# Altium project atfc.PrjPcb (part 1 of 2)
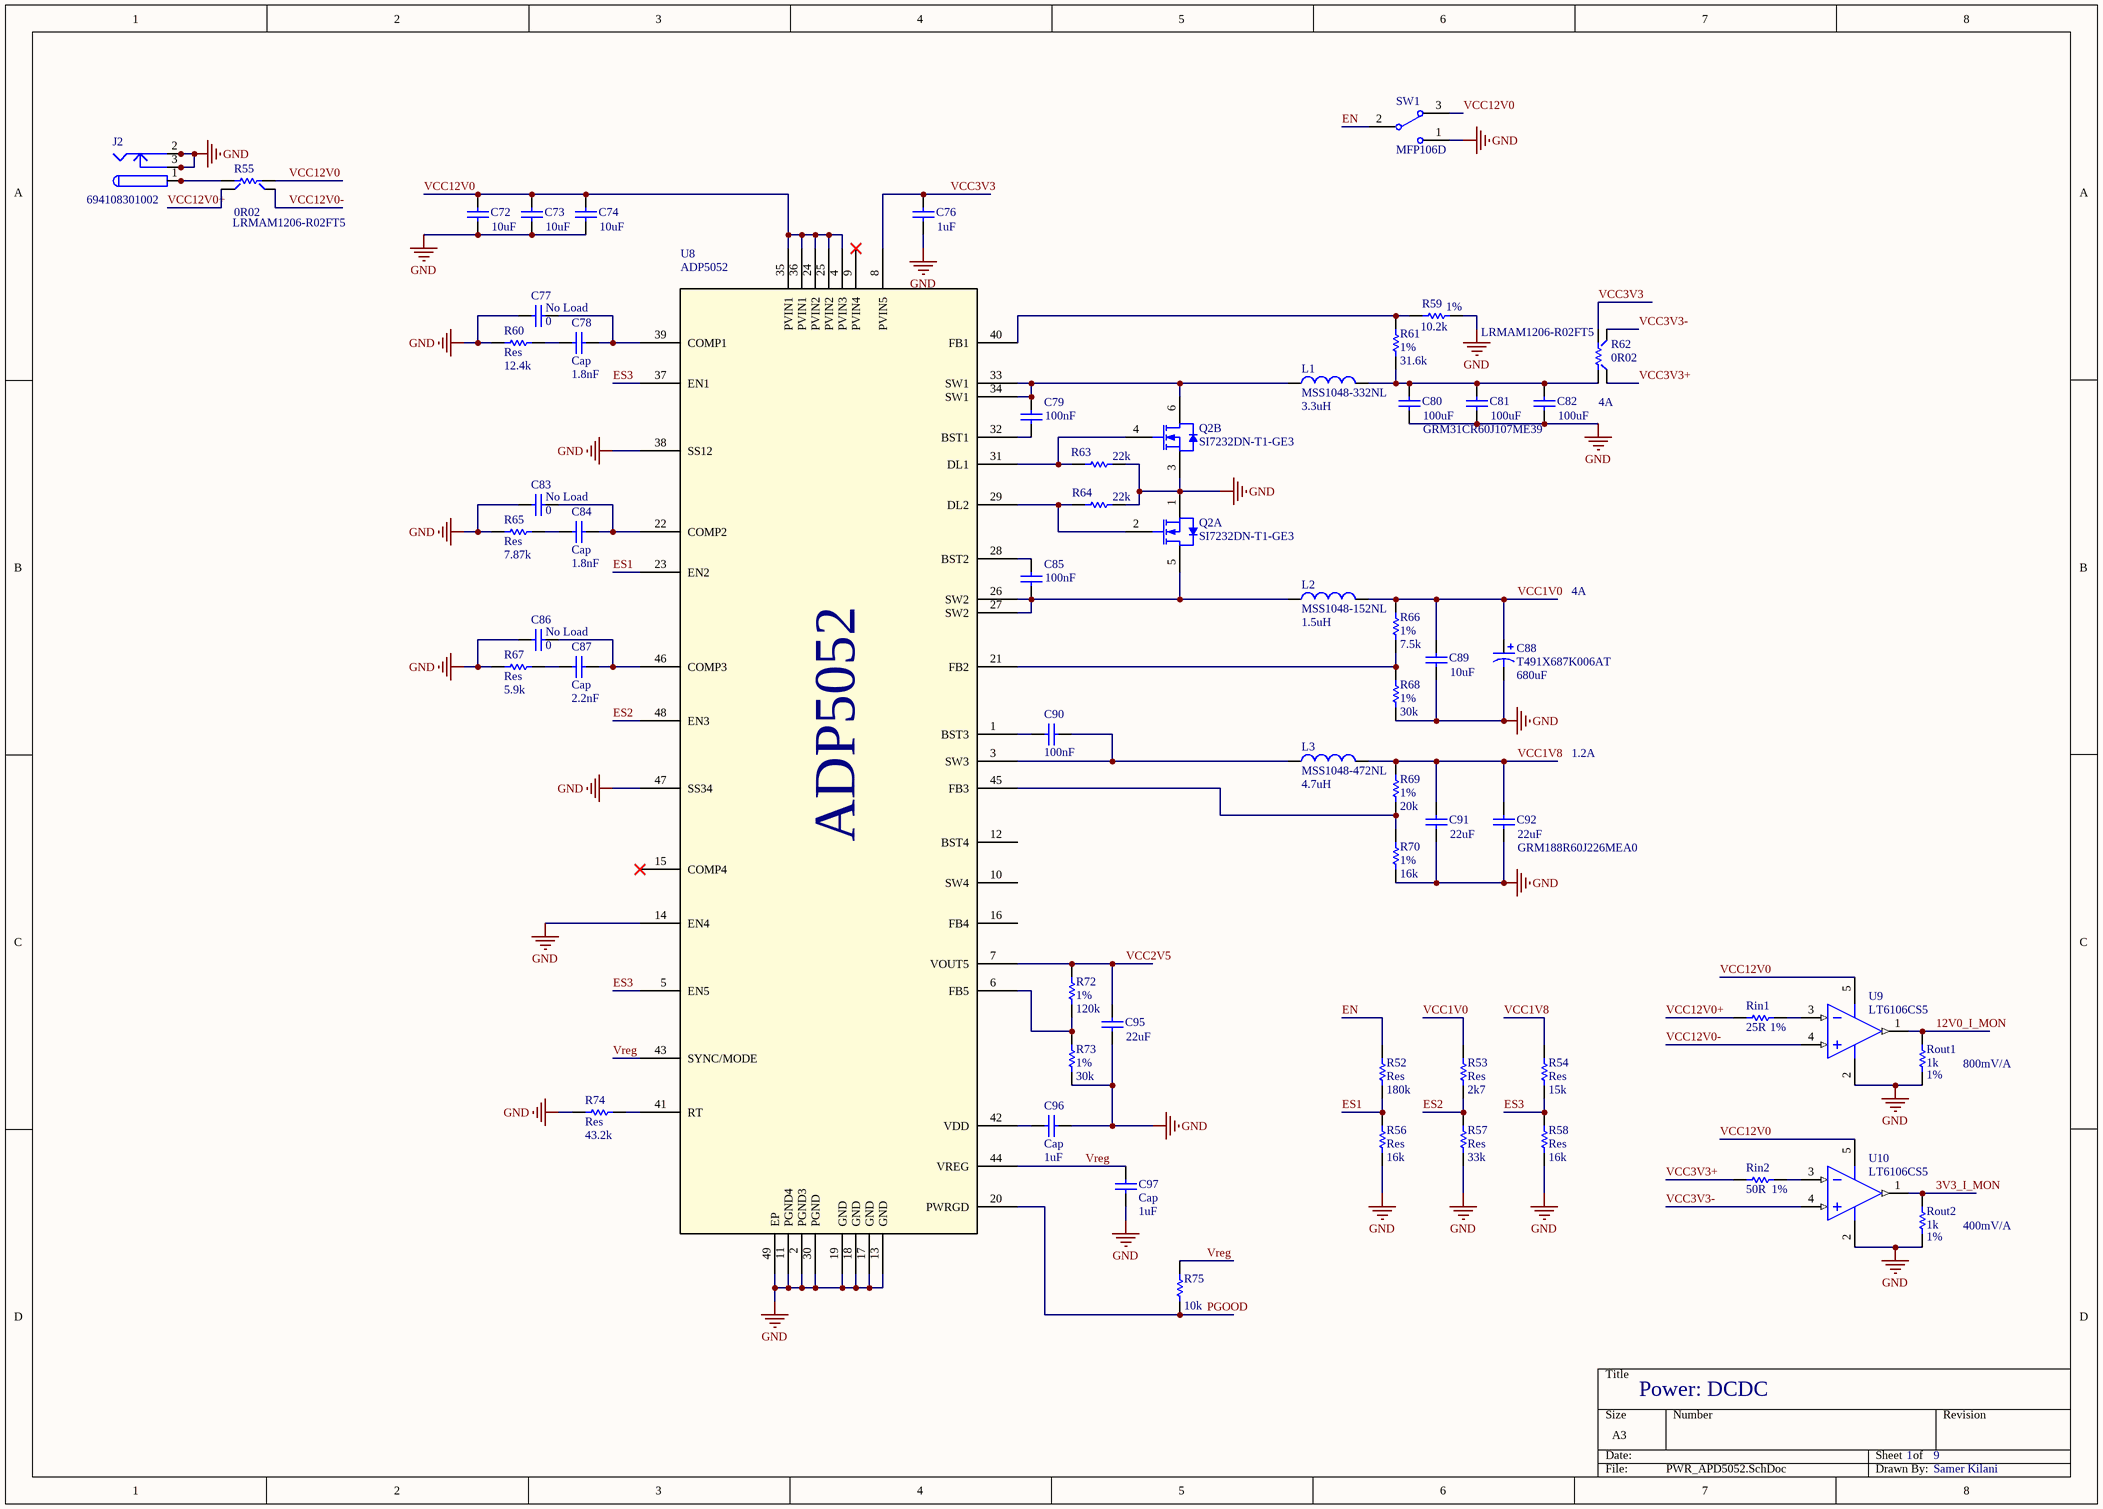
[diagram p0: PWR_APD5052.SchDoc]
Engineer: Samer Kilani
9 sheets, 292 parts. Net scope: global (net labels, ports and power ports of the same name join across sheets).
Board file: atfc.PcbDoc
Sheets:
  PWR_APD5052.SchDoc
  FPGA_PWR.SchDoc
  SFP.SchDoc
  IO.SchDoc
  FMC.SchDoc
  FPGA_Banks1.SchDoc
  FPGA_Banks2.SchDoc
  Regulators.SchDoc
  Config.SchDoc

## Sheet PWR_APD5052.SchDoc: Power: DCDC
size A3; Engineer: Samer Kilani; DocumentNumber: 1; SheetNumber: 1; SheetTotal: 9

### Parts
C72  value 10uF  [C0805]
C73  value 10uF  [C0805]
C74  value 10uF  [C0805]  (hidden comment: Cap)
C76  value 1uF  [C0402]
C77  No Load  value 0  [C0402]
C78  Cap  value 1.8nF  [C0402]
C79  value 100nF  [C0402]  (hidden comment: Cap)
C80  GRM31CR60J107ME39  value 100uF  [C1206]
C81  value 100uF  [C1206]  (hidden comment: GRM31CR60J107ME39)
C82  value 100uF  [C1206]  (hidden comment: GRM31CR60J107ME39)
C83  No Load  value 0  [C0402]
C84  Cap  value 1.8nF  [C0402]
C85  value 100nF  [C0402]  (hidden comment: Cap)
C86  No Load  value 0  [C0402]
C87  Cap  value 2.2nF  [C0402]
C88  T491X687K006AT  value 680uF  [C7343]
C89  value 10uF  [C0603]  (hidden comment: Cap)
C90  value 100nF  [C0402]  (hidden comment: Cap)
C91  value 22uF  [C0603]  (hidden comment: GRM188R60J226MEA0)
C92  GRM188R60J226MEA0  value 22uF  [C0603]
C95  value 22uF  [C0603]  (hidden comment: Cap)
C96  Cap  value 1uF  [C0402]
C97  Cap  value 1uF  [C0402]
J2  694108301002  [KLD-0202]
L1  MSS1048-332NL  value 3.3uH  [MSS1048]
L2  MSS1048-152NL  value 1.5uH  [MSS1048]
L3  MSS1048-472NL  value 4.7uH  [MSS1048]
Q2  SI7232DN-T1-GE3  [1212-8dual]  (parts A,B of 2)
R52  Res  value 180k  [R0402]
R53  Res  value 2k7  [R0402]
R54  Res  value 15k  [R0402]
R55  LRMAM1206-R02FT5  value 0R02  [LRMA1206]  (net tie)
R56  Res  value 16k  [R0402]
R57  Res  value 33k  [R0402]
R58  Res  value 16k  [R0402]
R59  value 10.2k  Tolerance: 1%  [R0402]  (hidden comment: Res)
R60  Res  value 12.4k  [R0402]
R61  value 31.6k  Tolerance: 1%  [R0402]  (hidden comment: Res)
R62  LRMAM1206-R02FT5  value 0R02  [LRMA1206]  (net tie)
R63  value 22k  [R0402]  (hidden comment: Res)
R64  value 22k  [R0402]  (hidden comment: Res)
R65  Res  value 7.87k  [R0402]
R66  value 7.5k  Tolerance: 1%  [R0402]  (hidden comment: Res)
R67  Res  value 5.9k  [R0402]
R68  value 30k  Tolerance: 1%  [R0402]  (hidden comment: Res)
R69  value 20k  Tolerance: 1%  [R0402]  (hidden comment: Res)
R70  value 16k  Tolerance: 1%  [R0402]  (hidden comment: Res)
R72  value 120k  Tolerance: 1%  [R0402]  (hidden comment: Res)
R73  value 30k  Tolerance: 1%  [R0402]  (hidden comment: Res)
R74  Res  value 43.2k  [R0402]
R75  value 10k  [R0402]  (hidden comment: Res)
Rin1  value 25R  Tolerance: 1%  [R0402]  (hidden comment: Res)
Rin2  value 50R  Tolerance: 1%  [R0402]  (hidden comment: Res)
Rout1  value 1k  Tolerance: 1%  [R0402]  (hidden comment: Res)
Rout2  value 1k  Tolerance: 1%  [R0402]  (hidden comment: Res)
SW1  MFP106D  [MFP106D]
U8  ADP5052  [CP_48_13]
U9  LT6106CS5  [LT-S5-5-TSOT-23_N]
U10  LT6106CS5  [LT-S5-5-TSOT-23_N]

### Nets
GND: C72.1 C73.1 C74.1 C76.1 C77.1 C80.1 C81.1 C82.1 C83.1 C86.1 C88.2 C89.1 C91.1 C92.1 C95.1 C96.1 C97.1 J2.2 J2.2A J2.2B J2.3 J2.3A J2.3B Q2.1(S1) Q2.3(S2) R56.1 R57.1 R58.1 R59.2 R60.1 R63.2 R64.2 R65.1 R67.1 R68.1 R70.1 R73.1 R74.1 Rout1.1 Rout2.1 SW1.1 U8.2(PGND3) U8.11(PGND4) U8.13(GND) U8.14(EN4) U8.17(GND) U8.18(GND) U8.19(GND) U8.30(PGND) U8.38(SS12) U8.47(SS34) U8.49(EP) U9.2(V-) U10.2(V-)
3V3_I_MON: Rout2.2 U10.1(OUT)
12V0_I_MON: Rout1.2 U9.1(OUT)
EN: R52.2 SW1.2
ES1: R52.1 R56.2 U8.23(EN2)
ES2: R53.1 R57.2 U8.48(EN3)
ES3: R54.1 R58.2 U8.5(EN5) U8.37(EN1)
PGOOD: R75.1 U8.20(PWRGD)
VCC1V0: C88.1 C89.2 L2.2 R53.2 R66.2
VCC1V8: C91.2 C92.2 L3.2 R54.2 R69.2
VCC2V5: C95.2 R72.2 U8.7(VOUT5)
VCC3V3: C76.2 R62.2 U8.8(PVIN5)
VCC3V3+: R62.3 Rin2.1
VCC3V3-: R62.4 U10.4(+IN)
VCC12V0: C72.2 C73.2 C74.2 R55.2 SW1.3 U8.4(PVIN3) U8.24(PVIN2) U8.25(PVIN2) U8.35(PVIN1) U8.36(PVIN1) U9.5(V+) U10.5(V+)
VCC12V0+: R55.3 Rin1.1
VCC12V0-: R55.4 U9.4(+IN)
Vreg: C97.2 R75.2 U8.43(SYNC/MODE) U8.44(VREG)
NetC77_2: C77.2 C78.2 U8.39(COMP1)
NetC78_1: C78.1 R60.2
NetC79_1: C79.1 U8.32(BST1)
NetC79_2: C79.2 L1.1 Q2.6(D2) U8.33(SW1) U8.34(SW1)
NetC80_2: C80.2 C81.2 C82.2 L1.2 R61.1 R62.1
NetC83_2: C83.2 C84.2 U8.22(COMP2)
NetC84_1: C84.1 R65.2
NetC85_1: C85.1 L2.1 Q2.5(D1) U8.26(SW2) U8.27(SW2)
NetC85_2: C85.2 U8.28(BST2)
NetC86_2: C86.2 C87.2 U8.46(COMP3)
NetC87_1: C87.1 R67.2
NetC90_1: C90.1 L3.1 U8.3(SW3)
NetC90_2: C90.2 U8.1(BST3)
NetC96_2: C96.2 U8.42(VDD)
NetJ2_1: J2.1 J2.1A J2.1B R55.1
NetQ2_2: Q2.2(G1) R64.1 U8.29(DL2)
NetQ2_4: Q2.4(G2) R63.1 U8.31(DL1)
NetR59_1: R59.1 R61.2 U8.40(FB1)
NetR66_1: R66.1 R68.2 U8.21(FB2)
NetR69_1: R69.1 R70.2 U8.45(FB3)
NetR72_1: R72.1 R73.2 U8.6(FB5)
NetR74_2: R74.2 U8.41(RT)
NetRin1_2: Rin1.2 U9.3(-IN)
NetRin2_2: Rin2.2 U10.3(-IN)

Not connected (* = marked no-connect by the designer): U8 9(PVIN4)* 10(SW4) 12(BST4) 15(COMP4)* 16(FB4)

### Notes on the sheet
- (near R62) 4A
- 4A
- 1.2A
- (near U8) ADP5052
- (near Rout1) 800mV/A
- (near Rout2) 400mV/A

### Library data of the parts
C72-C74 C76-C87 C89-C92 C95-C97 = Cap: Capacitor; Published: 8-Jun-2000; LatestRevisionDate: 17-Jul-2002; LatestRevisionNote: Re-released for DXP Platform.; PackageReference: RAD-0.3; Publisher: Altium Limited; PackageDescription: Radial Cap, Thru-Hole; 2 Leads; 0.3 in Pin Spacing
C88 = Cap Pol3: Polarized Capacitor (Surface Mount); Published: 8-Jun-2000; LatestRevisionDate: 29-May-2009; LatestRevisionNote: IPC-7351 Footprint Added.; PackageReference: C0805; Publisher: Altium Limited; PackageDescription: Chip Capacitor
J2 = PWR2.5: Low Voltage Power Supply Connector; Published: 17-Dec-2003; DatasheetDocument: 09-May-2002; Publisher: Altium Limited; ComponentLink1Description: Manufacturer Link; ComponentLink1URL: http://domino.kycon.com/internet/Products.html
L1-L3 = Inductor: Code_IEC: 1005; Published: 8-Jun-2000; LatestRevisionDate: 29-May-2009; LatestRevisionNote: IPC-7351 Footprint Added.; PackageReference: 0402-A; Publisher: Altium Limited; PackageDescription: Chip Inductor; Code_JEITA: 0402
R52-R54 R56-R61 R63-R70 R72-R75 Rin1 Rin2 Rout1 Rout2 = Res: Resistor
R55 R62 = Res_sense: Resistor
SW1 = SW-SPDT: SPDT Subminiature Toggle Switch, Right Angle Mounting, Vertical Actuation; Published: 24-Mar-1999; LatestRevisionDate: 17-Dec-2003; LatestRevisionNote: Schematic revised, PCB Footprint replaced.; DatasheetVersion: 05-Dec-2000; PackageReference: TL36WW15050; Publisher: Altium Limited; PackageDescription: Switch; 4 Leads; ComponentLink1Description: Manufacturer Link; ComponentLink1URL: http://www.apem.com
U8 = ADP5052ACPZ-R7: Imported; Value: Value; Type: Type; RefDes: RefDes
U9 U10 = LT6106CS5: Single Channel, Low Cost, High Side Current Sense Operational Amplifier, 0.2 MHz Typical GBW, 5-Pin SOT-23 (S5-5), Commercial; Linear Technology Part Number: LT6106; Manufacturer: Linear Technology; Channels (#): 1; GBW (MHz) Typical: 0.2; Is (mA) Typical: 0.06; Vos (mV) Guaranteed: 0.25; Vos (mV) Typical: 0.15; Vs Max (V): 36; Vs Min (V): 2.7; DatasheetVersion: Rev. A; PackageReference: LT-S5-5-TSOT-23; PackageDescription: 5-Lead Plastic TSOT-23, Body 1.63 x 2.90 mm, Pitch 0.95 mm; Type: CSA; Mounting Technology: Surface Mount; Code_JEDEC: MO-193; PartNumber: LT6106CS5; ComponentLink1Description: Manufacturer URL; ComponentLink1URL: http://www.linear.com/; ComponentLink2Description: Datasheet; ComponentLink2URL: http://cds.linear.com/docs/en/datasheet/6106fa.pdf; ComponentLink3Description: Package Specification; ComponentLink3URL: http://cds.linear.com/docs/en/packaging/SOT_5_05-08-1635.pdf

## Sheet FPGA_PWR.SchDoc: FPGA Power
size A4; Engineer: Samer Kilani; DocumentNumber: 2; SheetNumber: 2; SheetTotal: 9
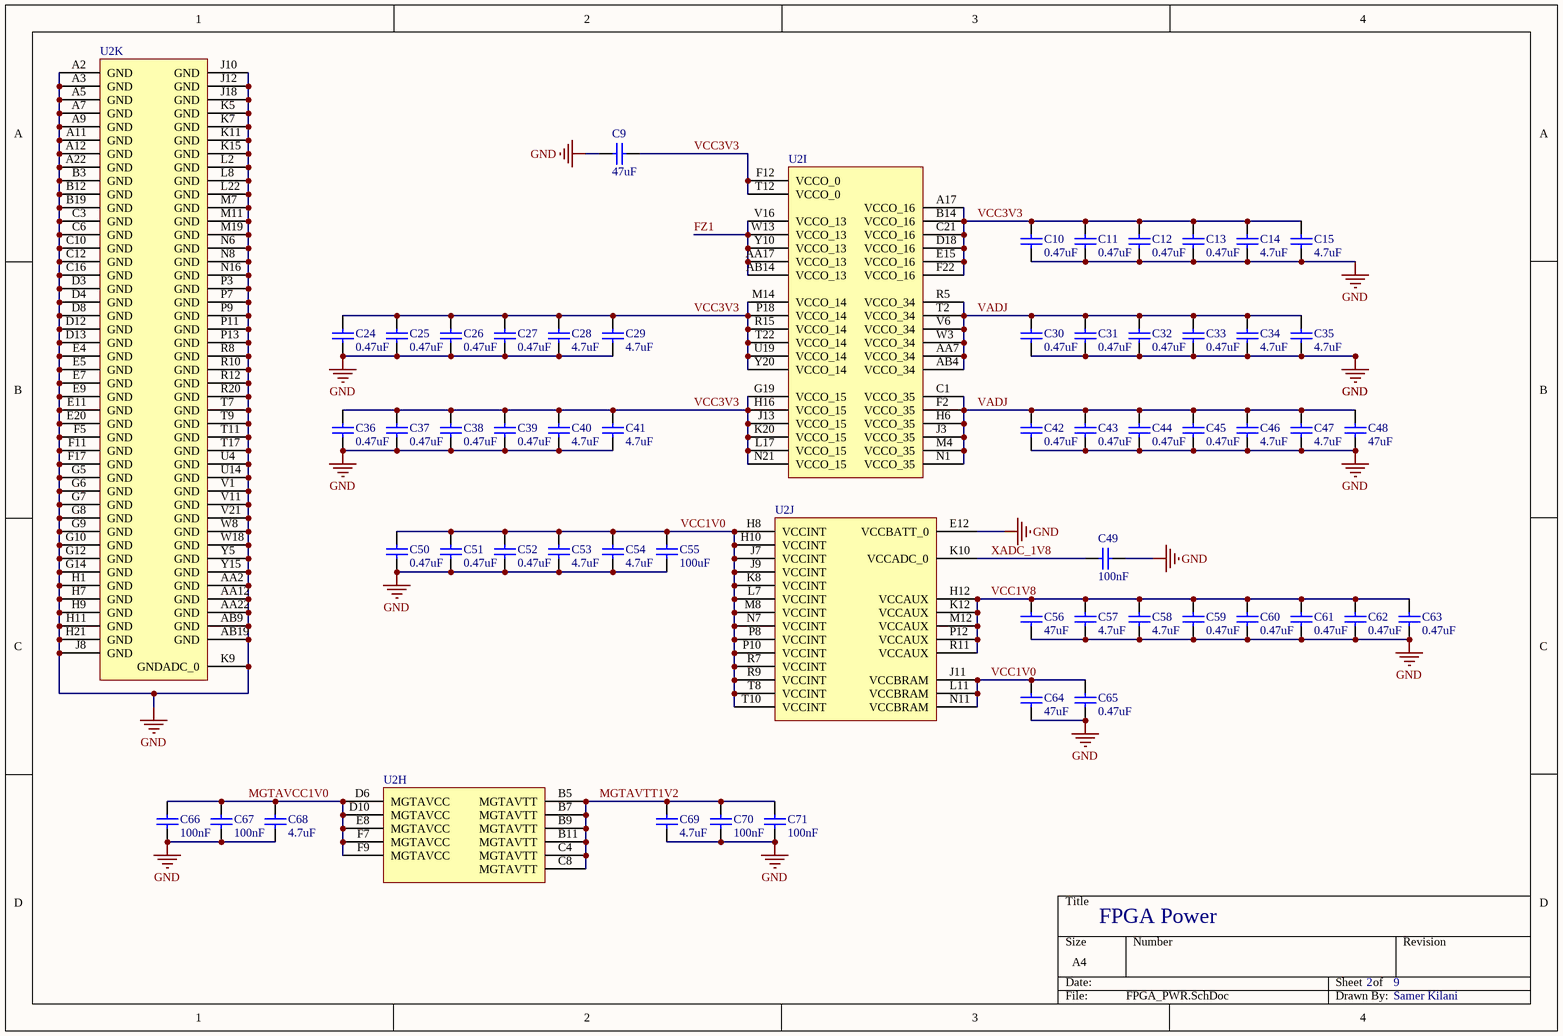
[diagram p1: FPGA_PWR.SchDoc]

### Parts
C9  value 47uF  [C1210]  (hidden comment: Cap)
C10  value 0.47uF  [C0402]  (hidden comment: Cap)
C11  value 0.47uF  [C0402]  (hidden comment: Cap)
C12  value 0.47uF  [C0402]  (hidden comment: Cap)
C13  value 0.47uF  [C0402]  (hidden comment: Cap)
C14  value 4.7uF  [C0805]  (hidden comment: Cap)
C15  value 4.7uF  [C0805]  (hidden comment: Cap)
C24  value 0.47uF  [C0402]  (hidden comment: Cap)
C25  value 0.47uF  [C0402]  (hidden comment: Cap)
C26  value 0.47uF  [C0402]  (hidden comment: Cap)
C27  value 0.47uF  [C0402]  (hidden comment: Cap)
C28  value 4.7uF  [C0805]  (hidden comment: Cap)
C29  value 4.7uF  [C0805]  (hidden comment: Cap)
C30  value 0.47uF  [C0402]  (hidden comment: Cap)
C31  value 0.47uF  [C0402]  (hidden comment: Cap)
C32  value 0.47uF  [C0402]  (hidden comment: Cap)
C33  value 0.47uF  [C0402]  (hidden comment: Cap)
C34  value 4.7uF  [C0805]  (hidden comment: Cap)
C35  value 4.7uF  [C0805]  (hidden comment: Cap)
C36  value 0.47uF  [C0402]  (hidden comment: Cap)
C37  value 0.47uF  [C0402]  (hidden comment: Cap)
C38  value 0.47uF  [C0402]  (hidden comment: Cap)
C39  value 0.47uF  [C0402]  (hidden comment: Cap)
C40  value 4.7uF  [C0805]  (hidden comment: Cap)
C41  value 4.7uF  [C0805]  (hidden comment: Cap)
C42  value 0.47uF  [C0402]  (hidden comment: Cap)
C43  value 0.47uF  [C0402]  (hidden comment: Cap)
C44  value 0.47uF  [C0402]  (hidden comment: Cap)
C45  value 0.47uF  [C0402]  (hidden comment: Cap)
C46  value 4.7uF  [C0805]  (hidden comment: Cap)
C47  value 4.7uF  [C0805]  (hidden comment: Cap)
C48  value 47uF  [C1210]  (hidden comment: Cap)
C49  value 100nF  [C0402]  (hidden comment: Cap)
C50  value 0.47uF  [C0402]  (hidden comment: Cap)
C51  value 0.47uF  [C0402]  (hidden comment: Cap)
C52  value 0.47uF  [C0402]  (hidden comment: Cap)
C53  value 4.7uF  [C0805]  (hidden comment: Cap)
C54  value 4.7uF  [C0805]  (hidden comment: Cap)
C55  value 100uF  [C1210]  (hidden comment: Cap)
C56  value 47uF  [C1210]  (hidden comment: Cap)
C57  value 4.7uF  [C0805]  (hidden comment: Cap)
C58  value 4.7uF  [C0805]  (hidden comment: Cap)
C59  value 0.47uF  [C0402]  (hidden comment: Cap)
C60  value 0.47uF  [C0402]  (hidden comment: Cap)
C61  value 0.47uF  [C0402]  (hidden comment: Cap)
C62  value 0.47uF  [C0402]  (hidden comment: Cap)
C63  value 0.47uF  [C0402]  (hidden comment: Cap)
C64  value 47uF  [C1210]  (hidden comment: Cap)
C65  value 0.47uF  [C0402]  (hidden comment: Cap)
C66  value 100nF  [C0402]  (hidden comment: Cap)
C67  value 100nF  [C0402]  (hidden comment: Cap)
C68  value 4.7uF  [C0805]  (hidden comment: Cap)
C69  value 4.7uF  [C0805]  (hidden comment: Cap)
C70  value 100nF  [C0402]  (hidden comment: Cap)
C71  value 100nF  [C0402]  (hidden comment: Cap)
U2  (no value)  [FGG484]  (parts H,I,J,K of 12)

### Nets
GND: C9.2 C10.2 C11.2 C12.2 C13.2 C14.2 C15.2 C24.2 C25.2 C26.2 C27.2 C28.2 C29.2 C30.2 C31.2 C32.2 C33.2 C34.2 C35.2 C36.2 C37.2 C38.2 C39.2 C40.2 C41.2 C42.2 C43.2 C44.2 C45.2 C46.2 C47.2 C48.2 C49.1 C50.2 C51.2 C52.2 C53.2 C54.2 C55.2 C56.2 C57.2 C58.2 C59.2 C60.2 C61.2 C62.2 C63.2 C64.2 C65.2 C66.2 C67.2 C68.2 C69.1 C70.1 C71.1 U2.A2(GND) U2.A3(GND) U2.A5(GND) U2.A7(GND) U2.A9(GND) U2.A11(GND) U2.A12(GND) U2.A22(GND) U2.AA2(GND) U2.AA12(GND) U2.AA22(GND) U2.AB9(GND) U2.AB19(GND) U2.B3(GND) U2.B12(GND) U2.B19(GND) U2.C3(GND) U2.C6(GND) U2.C10(GND) U2.C12(GND) U2.C16(GND) U2.D3(GND) U2.D4(GND) U2.D8(GND) U2.D12(GND) U2.D13(GND) U2.E4(GND) U2.E5(GND) U2.E7(GND) U2.E9(GND) U2.E11(GND) U2.E12(VCCBATT_0) U2.E20(GND) U2.F5(GND) U2.F11(GND) U2.F17(GND) U2.G5(GND) U2.G6(GND) U2.G7(GND) U2.G8(GND) U2.G9(GND) U2.G10(GND) U2.G12(GND) U2.G14(GND) U2.H1(GND) U2.H7(GND) U2.H9(GND) U2.H11(GND) U2.H21(GND) U2.J8(GND) U2.J10(GND) U2.J12(GND) U2.J18(GND) U2.K5(GND) U2.K7(GND) U2.K9(GNDADC_0) U2.K11(GND) U2.K15(GND) U2.L2(GND) U2.L8(GND) U2.L22(GND) U2.M7(GND) U2.M11(GND) U2.M19(GND) U2.N6(GND) U2.N8(GND) U2.N16(GND) U2.P3(GND) U2.P7(GND) U2.P9(GND) U2.P11(GND) U2.P13(GND) U2.R8(GND) U2.R10(GND) U2.R12(GND) U2.R20(GND) U2.T7(GND) U2.T9(GND) U2.T11(GND) U2.T17(GND) U2.U4(GND) U2.U14(GND) U2.V1(GND) U2.V11(GND) U2.V21(GND) U2.W8(GND) U2.W18(GND) U2.Y5(GND) U2.Y15(GND)
FZ1: U2.AA17(VCCO_13) U2.AB14(VCCO_13) U2.V16(VCCO_13) U2.W13(VCCO_13) U2.Y10(VCCO_13)
MGTAVCC1V0: C66.1 C67.1 C68.1 U2.D6(MGTAVCC) U2.D10(MGTAVCC) U2.E8(MGTAVCC) U2.F7(MGTAVCC) U2.F9(MGTAVCC)
MGTAVTT1V2: C69.2 C70.2 C71.2 U2.B5(MGTAVTT) U2.B7(MGTAVTT) U2.B9(MGTAVTT) U2.B11(MGTAVTT) U2.C4(MGTAVTT) U2.C8(MGTAVTT)
VADJ: C30.1 C31.1 C32.1 C33.1 C34.1 C35.1 C42.1 C43.1 C44.1 C45.1 C46.1 C47.1 C48.1 U2.AA7(VCCO_34) U2.AB4(VCCO_34) U2.C1(VCCO_35) U2.F2(VCCO_35) U2.H6(VCCO_35) U2.J3(VCCO_35) U2.M4(VCCO_35) U2.N1(VCCO_35) U2.R5(VCCO_34) U2.T2(VCCO_34) U2.V6(VCCO_34) U2.W3(VCCO_34)
VCC1V0: C50.1 C51.1 C52.1 C53.1 C54.1 C55.1 C64.1 C65.1 U2.H8(VCCINT) U2.H10(VCCINT) U2.J7(VCCINT) U2.J9(VCCINT) U2.J11(VCCBRAM) U2.K8(VCCINT) U2.L7(VCCINT) U2.L11(VCCBRAM) U2.M8(VCCINT) U2.N7(VCCINT) U2.N11(VCCBRAM) U2.P8(VCCINT) U2.P10(VCCINT) U2.R7(VCCINT) U2.R9(VCCINT) U2.T8(VCCINT) U2.T10(VCCINT)
VCC1V8: C56.1 C57.1 C58.1 C59.1 C60.1 C61.1 C62.1 C63.1 U2.H12(VCCAUX) U2.K12(VCCAUX) U2.M12(VCCAUX) U2.P12(VCCAUX) U2.R11(VCCAUX)
VCC3V3: C9.1 C10.1 C11.1 C12.1 C13.1 C14.1 C15.1 C24.1 C25.1 C26.1 C27.1 C28.1 C29.1 C36.1 C37.1 C38.1 C39.1 C40.1 C41.1 U2.A17(VCCO_16) U2.B14(VCCO_16) U2.C21(VCCO_16) U2.D18(VCCO_16) U2.E15(VCCO_16) U2.F12(VCCO_0) U2.F22(VCCO_16) U2.G19(VCCO_15) U2.H16(VCCO_15) U2.J13(VCCO_15) U2.K20(VCCO_15) U2.L17(VCCO_15) U2.M14(VCCO_14) U2.N21(VCCO_15) U2.P18(VCCO_14) U2.R15(VCCO_14) U2.T12(VCCO_0) U2.T22(VCCO_14) U2.U19(VCCO_14) U2.Y20(VCCO_14)
XADC_1V8: C49.2 U2.K10(VCCADC_0)

### Library data of the parts
C9-C15 C24-C71 = Cap: Capacitor; Published: 8-Jun-2000; LatestRevisionDate: 17-Jul-2002; LatestRevisionNote: Re-released for DXP Platform.; PackageReference: RAD-0.3; Publisher: Altium Limited; PackageDescription: Radial Cap, Thru-Hole; 2 Leads; 0.3 in Pin Spacing
U2 = XC7A35T-1FGG484C: Artix-7 FPGA, 250 User I/Os, 4 GTP, 484-Ball BGA, Speed Grade 1, Commercial Grade, Pb-Free; Manufacturer: Xilinx; Total Block RAM: 1800 Kb; GTP: 4; Clock Mgmt Tiles (CMTs): 5; Logic Cells: 33280; Available User I/O: 250; Speed Grades: 1; DatasheetVersion: v1.15; PackageVersion: Rev. 1.11; PackageReference: FGG484; PackageDescription: 484-Ball Wire-Bond Fine-Pitch BGA, Body 23 x 23 mm, Pitch 1 mm; Maximum Distributed RAM: 400 Kb; Operating Temperature Range: Commercial; NexusDeviceID: XC7A35T-1FGG484C; Mounting Technology: Surface Mount; PartNumber: XC7A35T-1FGG484C; ComponentLink1Description: Manufacturer URL; ComponentLink1URL: http://www.xilinx.com/; ComponentLink2Description: Datasheet; ComponentLink2URL: http://www.xilinx.com/support/documentation/data_sheets/ds180_7Series_Overview.pdf; ComponentLink3Description: Package Specification; ComponentLink3URL: http://www.xilinx.com/support/documentation/user_guides/ug475_7Series_Pkg_Pinout.pdf; ComponentLink4Description: DC and Switching Characteristics; ComponentLink4URL: http://www.xilinx.com/support/documentation/data_sheets/ds181_Artix_7_Data_Sheet.pdf; ComponentLink5Description: Package File; ComponentLink5URL: http://www.xilinx.com/support/packagefiles/a7packages/xc7a200tsbg484pkg.txt; ComponentLink6Description: Packaging and Pinout; ComponentLink6URL: http://www.xilinx.com/support/documentation/user_guides/ug475_7Series_Pkg_Pinout.pdf

## Sheet SFP.SchDoc: SFP
size OrCAD A; Engineer: Samer Kilani; DocumentNumber: 3; SheetNumber: 3; SheetTotal: 9
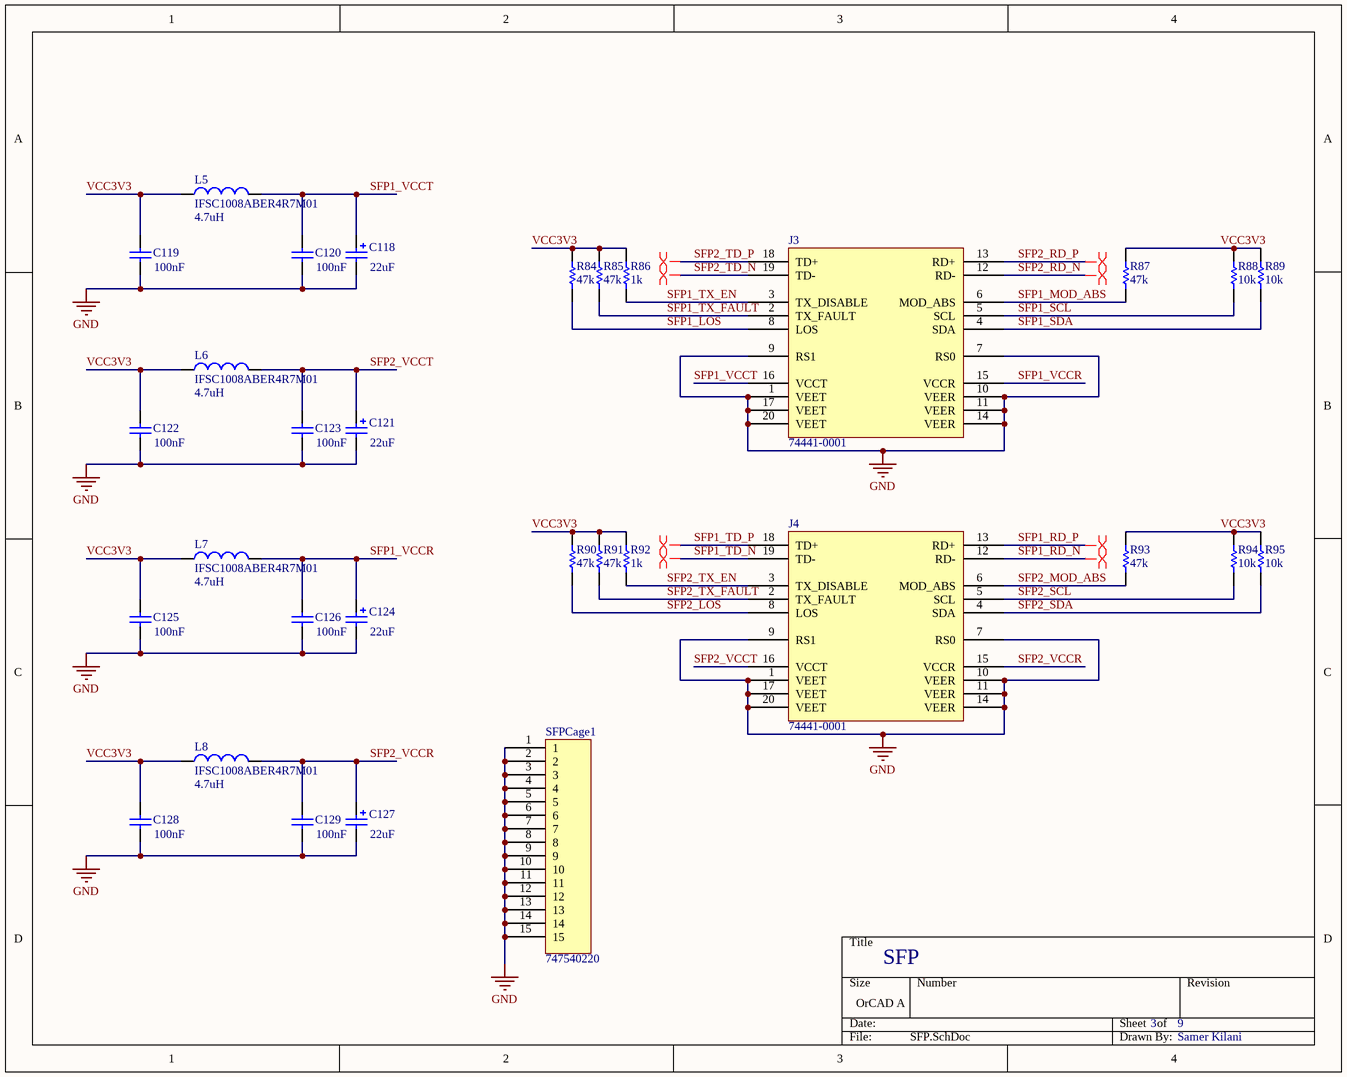
[diagram p2: SFP.SchDoc]

### Parts
C118  value 22uF  [C1206_P]
C119  value 100nF  [C0402]  (hidden comment: Cap)
C120  value 100nF  [C0402]  (hidden comment: Cap)
C121  value 22uF  [C1206_P]
C122  value 100nF  [C0402]  (hidden comment: Cap)
C123  value 100nF  [C0402]  (hidden comment: Cap)
C124  value 22uF  [C1206_P]
C125  value 100nF  [C0402]  (hidden comment: Cap)
C126  value 100nF  [C0402]  (hidden comment: Cap)
C127  value 22uF  [C1206_P]
C128  value 100nF  [C0402]  (hidden comment: Cap)
C129  value 100nF  [C0402]  (hidden comment: Cap)
J3  74441-0001  [SFP+20]
J4  74441-0001  [SFP+20]
L5  IFSC1008ABER4R7M01  value 4.7uH  [IFSC-ER]
L6  IFSC1008ABER4R7M01  value 4.7uH  [IFSC-ER]
L7  IFSC1008ABER4R7M01  value 4.7uH  [IFSC-ER]
L8  IFSC1008ABER4R7M01  value 4.7uH  [IFSC-ER]
R84  value 47k  [R0603]  (hidden comment: Res)
R85  value 47k  [R0603]  (hidden comment: Res)
R86  value 1k  [R0603]  (hidden comment: Res)
R87  value 47k  [R0603]  (hidden comment: Res)
R88  value 10k  [R0603]  (hidden comment: Res)
R89  value 10k  [R0603]  (hidden comment: Res)
R90  value 47k  [R0603]  (hidden comment: Res)
R91  value 47k  [R0603]  (hidden comment: Res)
R92  value 1k  [R0603]  (hidden comment: Res)
R93  value 47k  [R0603]  (hidden comment: Res)
R94  value 10k  [R0603]  (hidden comment: Res)
R95  value 10k  [R0603]  (hidden comment: Res)
SFPCage1  747540220  [SFPcage - dual]

### Nets
GND: C118.2 C119.1 C120.1 C121.2 C122.1 C123.1 C124.2 C125.1 C126.1 C127.2 C128.1 C129.1 J3.1(VEET) J3.7(RS0) J3.9(RS1) J3.10(VEER) J3.11(VEER) J3.14(VEER) J3.17(VEET) J3.20(VEET) J4.1(VEET) J4.7(RS0) J4.9(RS1) J4.10(VEER) J4.11(VEER) J4.14(VEER) J4.17(VEET) J4.20(VEET) SFPCage1.1 SFPCage1.2 SFPCage1.3 SFPCage1.4 SFPCage1.5 SFPCage1.6 SFPCage1.7 SFPCage1.8 SFPCage1.9 SFPCage1.10 SFPCage1.11 SFPCage1.12 SFPCage1.13 SFPCage1.14 SFPCage1.15
SFP1_LOS: J3.8(LOS) R84.2
SFP1_MOD_ABS: J3.6(MOD_ABS) R87.2
SFP1_RD_N: J4.12(RD-)
SFP1_RD_P: J4.13(RD+)
SFP1_SCL: J3.5(SCL) R88.2
SFP1_SDA: J3.4(SDA) R89.2
SFP1_TD_N: J4.19(TD-)
SFP1_TD_P: J4.18(TD+)
SFP1_TX_EN: J3.3(TX_DISABLE) R86.2
SFP1_TX_FAULT: J3.2(TX_FAULT) R85.2
SFP1_VCCR: C124.1 C126.2 J3.15(VCCR) L7.2
SFP1_VCCT: C118.1 C120.2 J3.16(VCCT) L5.2
SFP2_LOS: J4.8(LOS) R90.2
SFP2_MOD_ABS: J4.6(MOD_ABS) R93.2
SFP2_RD_N: J3.12(RD-)
SFP2_RD_P: J3.13(RD+)
SFP2_SCL: J4.5(SCL) R94.2
SFP2_SDA: J4.4(SDA) R95.2
SFP2_TD_N: J3.19(TD-)
SFP2_TD_P: J3.18(TD+)
SFP2_TX_EN: J4.3(TX_DISABLE) R92.2
SFP2_TX_FAULT: J4.2(TX_FAULT) R91.2
SFP2_VCCR: C127.1 C129.2 J4.15(VCCR) L8.2
SFP2_VCCT: C121.1 C123.2 J4.16(VCCT) L6.2
VCC3V3: C119.2 C122.2 C125.2 C128.2 L5.1 L6.1 L7.1 L8.1 R84.1 R85.1 R86.1 R87.1 R88.1 R89.1 R90.1 R91.1 R92.1 R93.1 R94.1 R95.1

### Layout directives
differential pair: SFP1_RD_N, SFP1_RD_P, SFP1_TD_N, SFP1_TD_P, SFP2_RD_N, SFP2_RD_P, SFP2_TD_N, SFP2_TD_P

### Library data of the parts
C118 C121 C124 C127 = Cap Pol: Polarized Capacitor (Surface Mount); Published: 8-Jun-2000; LatestRevisionDate: 29-May-2009; LatestRevisionNote: IPC-7351 Footprint Added.; PackageReference: C0805; Publisher: Altium Limited; PackageDescription: Chip Capacitor
C119 C120 C122 C123 C125 C126 C128 C129 = Cap: Capacitor; Published: 8-Jun-2000; LatestRevisionDate: 17-Jul-2002; LatestRevisionNote: Re-released for DXP Platform.; PackageReference: RAD-0.3; Publisher: Altium Limited; PackageDescription: Radial Cap, Thru-Hole; 2 Leads; 0.3 in Pin Spacing
J3 J4 = SFP+
L5-L8 = Inductor: Code_IEC: 1005; Published: 8-Jun-2000; LatestRevisionDate: 29-May-2009; LatestRevisionNote: IPC-7351 Footprint Added.; PackageReference: 0402-A; Publisher: Altium Limited; PackageDescription: Chip Inductor; Code_JEITA: 0402
R84-R95 = Res: Resistor
SFPCage1 = SFPcagedual

## Sheet IO.SchDoc: IO
size A4; Engineer: Samer Kilani; DocumentNumber: 4; SheetNumber: 4; SheetTotal: 9
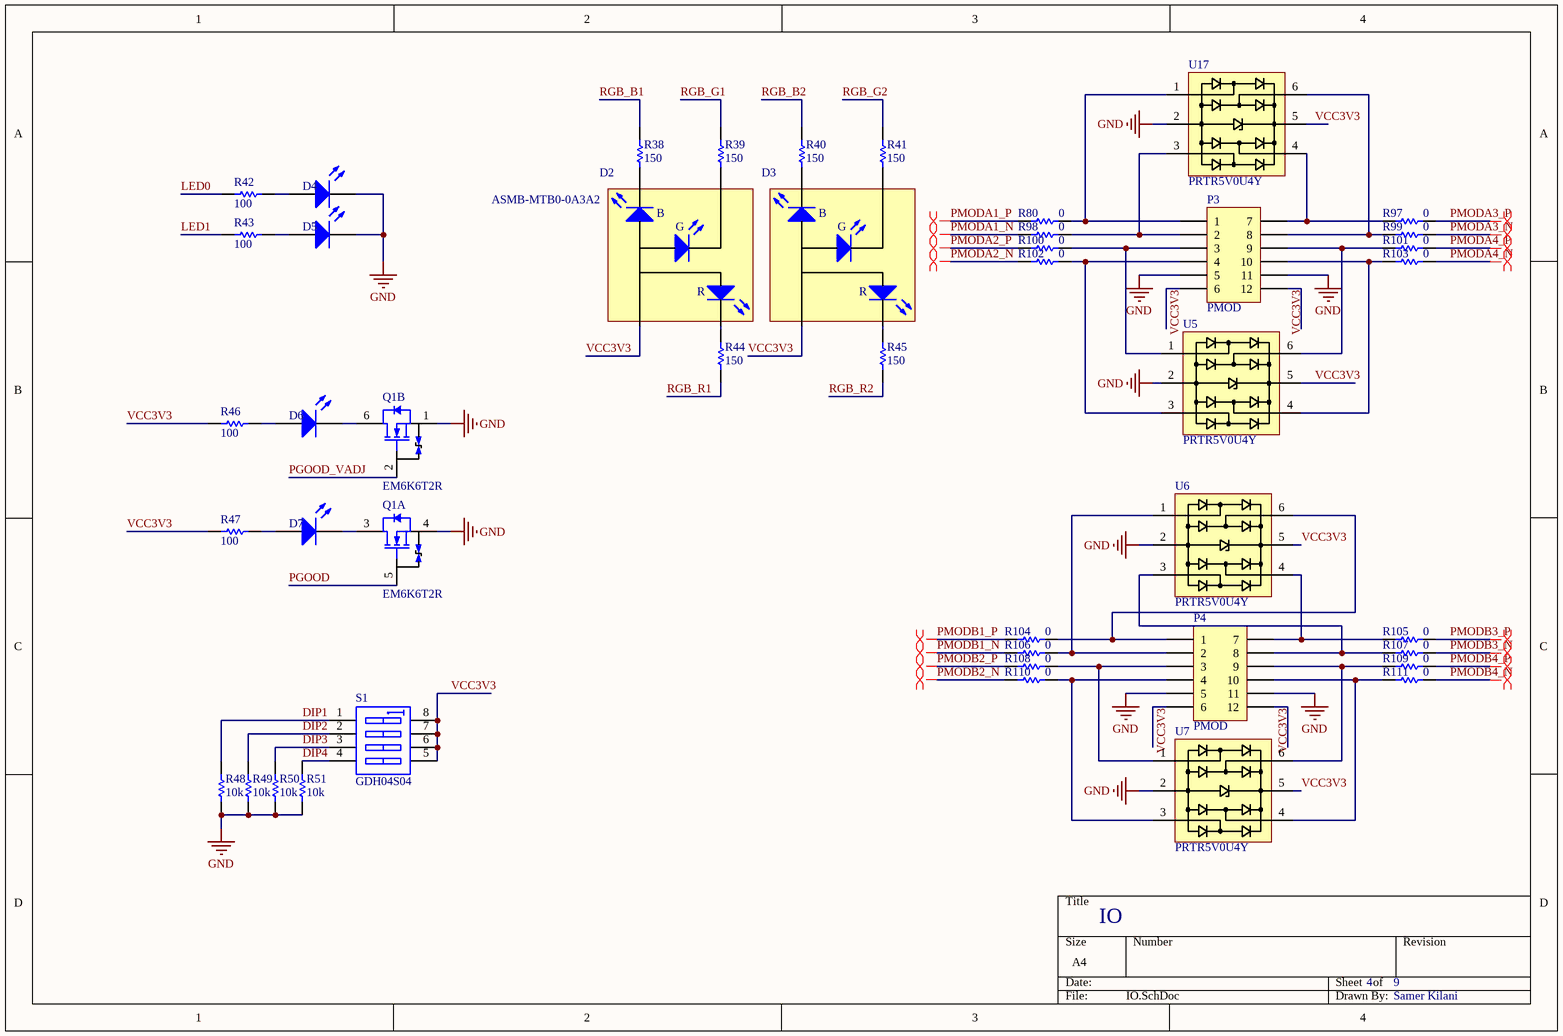
[diagram p3: IO.SchDoc]

### Parts
D2  ASMB-MTB0-0A3A2  [ASMB-MTB0-0A3A2]
D3  ASMB-MTB0-0A3A2  [ASMB-MTB0-0A3A2]  (value not drawn)
D4  KPT-1608EC  [KP-1608QBC-D]  (value not drawn)
D5  KPT-1608EC  [KP-1608QBC-D]  (value not drawn)
D6  KPT-1608EC  [KP-1608QBC-D]  (value not drawn)
D7  KPT-1608EC  [KP-1608QBC-D]  (value not drawn)
P3  PMOD  [PMOD_12]
P4  PMOD  [PMOD_12]
Q1  EM6K6T2R  [SOT-563]  (parts A,B of 2)
R38  value 150  [R0402]  (hidden comment: Res)
R39  value 150  [R0402]  (hidden comment: Res)
R40  value 150  [R0402]  (hidden comment: Res)
R41  value 150  [R0402]  (hidden comment: Res)
R42  value 100  [R0402]  (hidden comment: Res)
R43  value 100  [R0402]  (hidden comment: Res)
R44  value 150  [R0402]  (hidden comment: Res)
R45  value 150  [R0402]  (hidden comment: Res)
R46  value 100  [R0402]  (hidden comment: Res)
R47  value 100  [R0402]  (hidden comment: Res)
R48  value 10k  [R0402]  (hidden comment: Res)
R49  value 10k  [R0402]  (hidden comment: Res)
R50  value 10k  [R0402]  (hidden comment: Res)
R51  value 10k  [R0402]  (hidden comment: Res)
R80  value 0  [R0402]  (hidden comment: Res)
R97  value 0  [R0402]  (hidden comment: Res)
R98  value 0  [R0402]  (hidden comment: Res)
R99  value 0  [R0402]  (hidden comment: Res)
R100  value 0  [R0402]  (hidden comment: Res)
R101  value 0  [R0402]  (hidden comment: Res)
R102  value 0  [R0402]  (hidden comment: Res)
R103  value 0  [R0402]  (hidden comment: Res)
R104  value 0  [R0402]  (hidden comment: Res)
R105  value 0  [R0402]  (hidden comment: Res)
R106  value 0  [R0402]  (hidden comment: Res)
R107  value 0  [R0402]  (hidden comment: Res)
R108  value 0  [R0402]  (hidden comment: Res)
R109  value 0  [R0402]  (hidden comment: Res)
R110  value 0  [R0402]  (hidden comment: Res)
R111  value 0  [R0402]  (hidden comment: Res)
S1  GDH04S04  [DIP-SOP8]
U5  PRTR5V0U4Y  [SOT363]
U6  PRTR5V0U4Y  [SOT363]
U7  PRTR5V0U4Y  [SOT363]
U17  PRTR5V0U4Y  [SOT363]

### Nets
GND: D4.2(K) D5.2(K) P3.5 P3.11 P4.5 P4.11 Q1.1(S1) Q1.4(S1) R48.2 R49.2 R50.2 R51.2 U5.2 U6.2 U7.2 U17.2
DIP1: R48.1 S1.1(A1)
DIP2: R49.1 S1.2(A2)
DIP3: R50.1 S1.3(A3)
DIP4: R51.1 S1.4(A4)
LED0: R42.2
LED1: R43.2
PGOOD: Q1.5(G1)
PGOOD_VADJ: Q1.2(G1)
PMODA1_N: R98.1
PMODA1_P: R80.1
PMODA2_N: R102.1
PMODA2_P: R100.1
PMODA3_N: R99.2
PMODA3_P: R97.2
PMODA4_N: R103.2
PMODA4_P: R101.2
PMODB1_N: R106.1
PMODB1_P: R104.1
PMODB2_N: R110.1
PMODB2_P: R108.1
PMODB3_N: R107.2
PMODB3_P: R105.2
PMODB4_N: R111.2
PMODB4_P: R109.2
RGB_B1: R38.2
RGB_B2: R40.2
RGB_G1: R39.2
RGB_G2: R41.2
RGB_R1: R44.1
RGB_R2: R45.1
VCC3V3: D2.1(A) D3.1(A) P3.6 P3.12 P4.6 P4.12 R46.2 R47.2 S1.5(B4) S1.6(B3) S1.7(B2) S1.8(B1) U5.5 U6.5 U7.5 U17.5
NetD2_2: D2.2(B) R38.1
NetD2_3: D2.3(G) R39.1
NetD2_4: D2.4(R) R44.2
NetD3_2: D3.2(B) R40.1
NetD3_3: D3.3(G) R41.1
NetD3_4: D3.4(R) R45.2
NetD4_1: D4.1(A) R42.1
NetD5_1: D5.1(A) R43.1
NetD6_1: D6.1(A) R46.1
NetD6_2: D6.2(K) Q1.6(D1)
NetD7_1: D7.1(A) R47.1
NetD7_2: D7.2(K) Q1.3(D1)
NetP3_1: P3.1 R80.2 U17.1
NetP3_2: P3.2 R98.2 U17.3
NetP3_3: P3.3 R100.2 U5.1
NetP3_4: P3.4 R102.2 U5.3
NetP3_7: P3.7 R97.1 U17.4
NetP3_8: P3.8 R99.1 U17.6
NetP3_9: P3.9 R101.1 U5.6
NetP3_10: P3.10 R103.1 U5.4
NetP4_1: P4.1 R104.2 U6.6
NetP4_2: P4.2 R106.2 U6.1
NetP4_3: P4.3 R108.2 U7.1
NetP4_4: P4.4 R110.2 U7.3
NetP4_7: P4.7 R105.1 U6.4
NetP4_8: P4.8 R107.1 U6.3
NetP4_9: P4.9 R109.1 U7.6
NetP4_10: P4.10 R111.1 U7.4

### Layout directives
differential pair: PMODA1_N, PMODA1_P, PMODA2_N, PMODA2_P, PMODA3_N, PMODA3_P, PMODA4_N, PMODA4_P, PMODB1_N, PMODB1_P, PMODB2_N, PMODB2_P, PMODB3_N, PMODB3_P, PMODB4_N, PMODB4_P

### Library data of the parts
D2 D3 = LED_RGB: Typical INFRARED GaAs LED; Published: 8-Jun-2000; LatestRevisionDate: 08-Jul-2005; LatestRevisionNote: Mech Layer 1 removed.; PackageReference: LED-0; Publisher: Altium Limited; PackageDescription: LED; 2 Leads
D4-D7 = LED: Published: 8-Jun-2000; LatestRevisionDate: 08-Jul-2005; LatestRevisionNote: Mech Layer 1 removed.; PackageReference: LED-0; Publisher: Altium Limited; PackageDescription: LED; 2 Leads
P3 P4 = Header 6X2A: Header, 6-Pin, Dual row; LatestRevisionDate: 17-Jul-2002; LatestRevisionNote: Re-released for DXP Platform.; Publisher: Altium Limited
Q1 = EM6K6
R38-R51 R80 R97-R111 = Res: Resistor
S1 = SW DIP-4: DIP Switch, 4 Position, SPST; Published: 24-Mar-1999; LatestRevisionDate: 29-May-2009; LatestRevisionNote: IPC-7351 Footprint Added.; PackageVersion: Dec-2002; PackageReference: SO8; Publisher: Altium Limited; PackageDescription: 8-Pin Small Outline Integrated Circuit 1.27 mm Pitch; Code_JEDEC: MS-012-AA; Code_IPC: SOIC127P600-8

## Sheet FMC.SchDoc: FMC
size A4; Engineer: Samer Kilani; DocumentNumber: 5; SheetNumber: 5; SheetTotal: 9
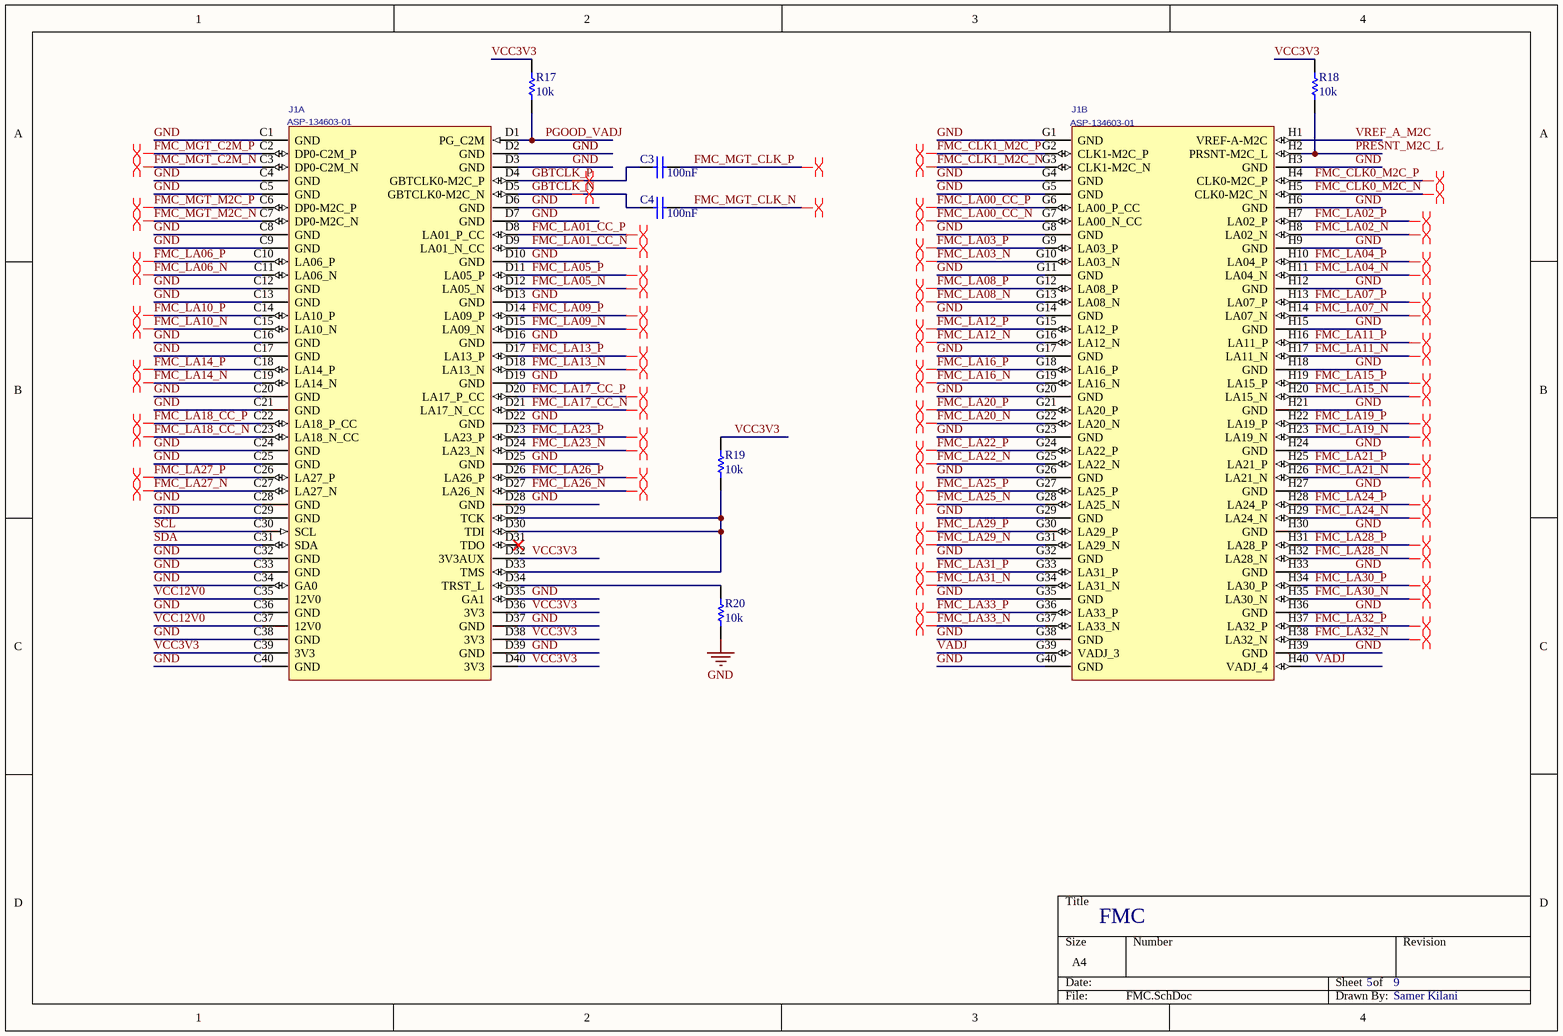
[diagram p4: FMC.SchDoc]

### Parts
C3  value 100nF  [C0402]  (hidden comment: Cap)
C4  value 100nF  [C0402]  (hidden comment: Cap)
J1  ASP-134603-01  [ASP-134603-01]  (parts A,B of 2)
R17  value 10k  [R0402]  (hidden comment: Res)
R18  value 10k  [R0402]  (hidden comment: Res)
R19  value 10k  [R0402]  (hidden comment: Res)
R20  value 10k  [R0402]  (hidden comment: Res)

### Nets
GND: J1.C1(GND) J1.C4(GND) J1.C5(GND) J1.C8(GND) J1.C9(GND) J1.C12(GND) J1.C13(GND) J1.C16(GND) J1.C17(GND) J1.C20(GND) J1.C21(GND) J1.C24(GND) J1.C25(GND) J1.C28(GND) J1.C29(GND) J1.C32(GND) J1.C33(GND) J1.C34(GA0) J1.C36(GND) J1.C38(GND) J1.C40(GND) J1.D2(GND) J1.D3(GND) J1.D6(GND) J1.D7(GND) J1.D10(GND) J1.D13(GND) J1.D16(GND) J1.D19(GND) J1.D22(GND) J1.D25(GND) J1.D28(GND) J1.D35(GA1) J1.D37(GND) J1.D39(GND) J1.G1(GND) J1.G4(GND) J1.G5(GND) J1.G8(GND) J1.G11(GND) J1.G14(GND) J1.G17(GND) J1.G20(GND) J1.G23(GND) J1.G26(GND) J1.G29(GND) J1.G32(GND) J1.G35(GND) J1.G38(GND) J1.G40(GND) J1.H3(GND) J1.H6(GND) J1.H9(GND) J1.H12(GND) J1.H15(GND) J1.H18(GND) J1.H21(GND) J1.H24(GND) J1.H27(GND) J1.H30(GND) J1.H33(GND) J1.H36(GND) J1.H39(GND) R20.1
FMC_CLK0_M2C_N: J1.H5(CLK0-M2C_N)
FMC_CLK0_M2C_P: J1.H4(CLK0-M2C_P)
FMC_CLK1_M2C_N: J1.G3(CLK1-M2C_N)
FMC_CLK1_M2C_P: J1.G2(CLK1-M2C_P)
FMC_LA00_CC_N: J1.G7(LA00_N_CC)
FMC_LA00_CC_P: J1.G6(LA00_P_CC)
FMC_LA01_CC_N: J1.D9(LA01_N_CC)
FMC_LA01_CC_P: J1.D8(LA01_P_CC)
FMC_LA02_N: J1.H8(LA02_N)
FMC_LA02_P: J1.H7(LA02_P)
FMC_LA03_N: J1.G10(LA03_N)
FMC_LA03_P: J1.G9(LA03_P)
FMC_LA04_N: J1.H11(LA04_N)
FMC_LA04_P: J1.H10(LA04_P)
FMC_LA05_N: J1.D12(LA05_N)
FMC_LA05_P: J1.D11(LA05_P)
FMC_LA06_N: J1.C11(LA06_N)
FMC_LA06_P: J1.C10(LA06_P)
FMC_LA07_N: J1.H14(LA07_N)
FMC_LA07_P: J1.H13(LA07_P)
FMC_LA08_N: J1.G13(LA08_N)
FMC_LA08_P: J1.G12(LA08_P)
FMC_LA09_N: J1.D15(LA09_N)
FMC_LA09_P: J1.D14(LA09_P)
FMC_LA10_N: J1.C15(LA10_N)
FMC_LA10_P: J1.C14(LA10_P)
FMC_LA11_N: J1.H17(LA11_N)
FMC_LA11_P: J1.H16(LA11_P)
FMC_LA12_N: J1.G16(LA12_N)
FMC_LA12_P: J1.G15(LA12_P)
FMC_LA13_N: J1.D18(LA13_N)
FMC_LA13_P: J1.D17(LA13_P)
FMC_LA14_N: J1.C19(LA14_N)
FMC_LA14_P: J1.C18(LA14_P)
FMC_LA15_N: J1.H20(LA15_N)
FMC_LA15_P: J1.H19(LA15_P)
FMC_LA16_N: J1.G19(LA16_N)
FMC_LA16_P: J1.G18(LA16_P)
FMC_LA17_CC_N: J1.D21(LA17_N_CC)
FMC_LA17_CC_P: J1.D20(LA17_P_CC)
FMC_LA18_CC_N: J1.C23(LA18_N_CC)
FMC_LA18_CC_P: J1.C22(LA18_P_CC)
FMC_LA19_N: J1.H23(LA19_N)
FMC_LA19_P: J1.H22(LA19_P)
FMC_LA20_N: J1.G22(LA20_N)
FMC_LA20_P: J1.G21(LA20_P)
FMC_LA21_N: J1.H26(LA21_N)
FMC_LA21_P: J1.H25(LA21_P)
FMC_LA22_N: J1.G25(LA22_N)
FMC_LA22_P: J1.G24(LA22_P)
FMC_LA23_N: J1.D24(LA23_N)
FMC_LA23_P: J1.D23(LA23_P)
FMC_LA24_N: J1.H29(LA24_N)
FMC_LA24_P: J1.H28(LA24_P)
FMC_LA25_N: J1.G28(LA25_N)
FMC_LA25_P: J1.G27(LA25_P)
FMC_LA26_N: J1.D27(LA26_N)
FMC_LA26_P: J1.D26(LA26_P)
FMC_LA27_N: J1.C27(LA27_N)
FMC_LA27_P: J1.C26(LA27_P)
FMC_LA28_N: J1.H32(LA28_N)
FMC_LA28_P: J1.H31(LA28_P)
FMC_LA29_N: J1.G31(LA29_N)
FMC_LA29_P: J1.G30(LA29_P)
FMC_LA30_N: J1.H35(LA30_N)
FMC_LA30_P: J1.H34(LA30_P)
FMC_LA31_N: J1.G34(LA31_N)
FMC_LA31_P: J1.G33(LA31_P)
FMC_LA32_N: J1.H38(LA32_N)
FMC_LA32_P: J1.H37(LA32_P)
FMC_LA33_N: J1.G37(LA33_N)
FMC_LA33_P: J1.G36(LA33_P)
FMC_MGT_C2M_N: J1.C3(DP0-C2M_N)
FMC_MGT_C2M_P: J1.C2(DP0-C2M_P)
FMC_MGT_CLK_N: C4.2
FMC_MGT_CLK_P: C3.2
FMC_MGT_M2C_N: J1.C7(DP0-M2C_N)
FMC_MGT_M2C_P: J1.C6(DP0-M2C_P)
GBTCLK_N: C4.1 J1.D5(GBTCLK0-M2C_N)
GBTCLK_P: C3.1 J1.D4(GBTCLK0-M2C_P)
PGOOD_VADJ: J1.D1(PG_C2M) R17.1
PRESNT_M2C_L: J1.H2(PRSNT-M2C_L) R18.1
SCL: J1.C30(SCL)
SDA: J1.C31(SDA)
VADJ: J1.G39(VADJ_3) J1.H40(VADJ_4)
VCC3V3: J1.C39(3V3) J1.D32(3V3AUX) J1.D36(3V3) J1.D38(3V3) J1.D40(3V3) R17.2 R18.2 R19.2
VCC12V0: J1.C35(12V0) J1.C37(12V0)
VREF_A_M2C: J1.H1(VREF-A-M2C)
NetJ1_D29: J1.D29(TCK) J1.D30(TDI) J1.D33(TMS) R19.1
NetJ1_D34: J1.D34(TRST_L) R20.2

Not connected (* = marked no-connect by the designer): J1 D31(TDO)*

### Layout directives
differential pair: FMC_CLK0_M2C_N, FMC_CLK0_M2C_P, FMC_CLK1_M2C_N, FMC_CLK1_M2C_P, FMC_LA00_CC_N, FMC_LA00_CC_P, FMC_LA01_CC_N, FMC_LA01_CC_P, FMC_LA02_N, FMC_LA02_P, FMC_LA03_N, FMC_LA03_P, FMC_LA04_N, FMC_LA04_P, FMC_LA05_N, FMC_LA05_P, FMC_LA06_N, FMC_LA06_P, FMC_LA07_N, FMC_LA07_P, FMC_LA08_N, FMC_LA08_P, FMC_LA09_N, FMC_LA09_P, FMC_LA10_N, FMC_LA10_P, FMC_LA11_N, FMC_LA11_P, FMC_LA12_N, FMC_LA12_P, FMC_LA13_N, FMC_LA13_P, FMC_LA14_N, FMC_LA14_P, FMC_LA15_N, FMC_LA15_P, FMC_LA16_N, FMC_LA16_P, FMC_LA17_CC_N, FMC_LA17_CC_P, FMC_LA18_CC_N, FMC_LA18_CC_P, FMC_LA19_N, FMC_LA19_P, FMC_LA20_N, FMC_LA20_P, FMC_LA21_N, FMC_LA21_P, FMC_LA22_N, FMC_LA22_P, FMC_LA23_N, FMC_LA23_P, FMC_LA24_N, FMC_LA24_P, FMC_LA25_N, FMC_LA25_P, FMC_LA26_N, FMC_LA26_P, FMC_LA27_N, FMC_LA27_P, FMC_LA28_N, FMC_LA28_P, FMC_LA29_N, FMC_LA29_P, FMC_LA30_N, FMC_LA30_P, FMC_LA31_N, FMC_LA31_P, FMC_LA32_N, FMC_LA32_P, FMC_LA33_N, FMC_LA33_P, FMC_MGT_C2M_N, FMC_MGT_C2M_P, FMC_MGT_CLK_N, FMC_MGT_CLK_P, FMC_MGT_M2C_N, FMC_MGT_M2C_P, GBTCLK_N, GBTCLK_P

### Library data of the parts
C3 C4 = Cap: Capacitor; Published: 8-Jun-2000; LatestRevisionDate: 17-Jul-2002; LatestRevisionNote: Re-released for DXP Platform.; PackageReference: RAD-0.3; Publisher: Altium Limited; PackageDescription: Radial Cap, Thru-Hole; 2 Leads; 0.3 in Pin Spacing
J1 = ASP-134603-01: 0.050" PITCH SOCKET ARRAY ASSEMBLY.; MANUFACTURER: SAMTEC; CREATED: February 27, 2014 - Wedny Xin; PCB DECAL: ASP-134603-01
R17-R20 = Res: Resistor

## Sheet FPGA_Banks1.SchDoc: FPGA Banks 1
size A4; Engineer: Samer Kilani; DocumentNumber: 6; SheetNumber: 6; SheetTotal: 9
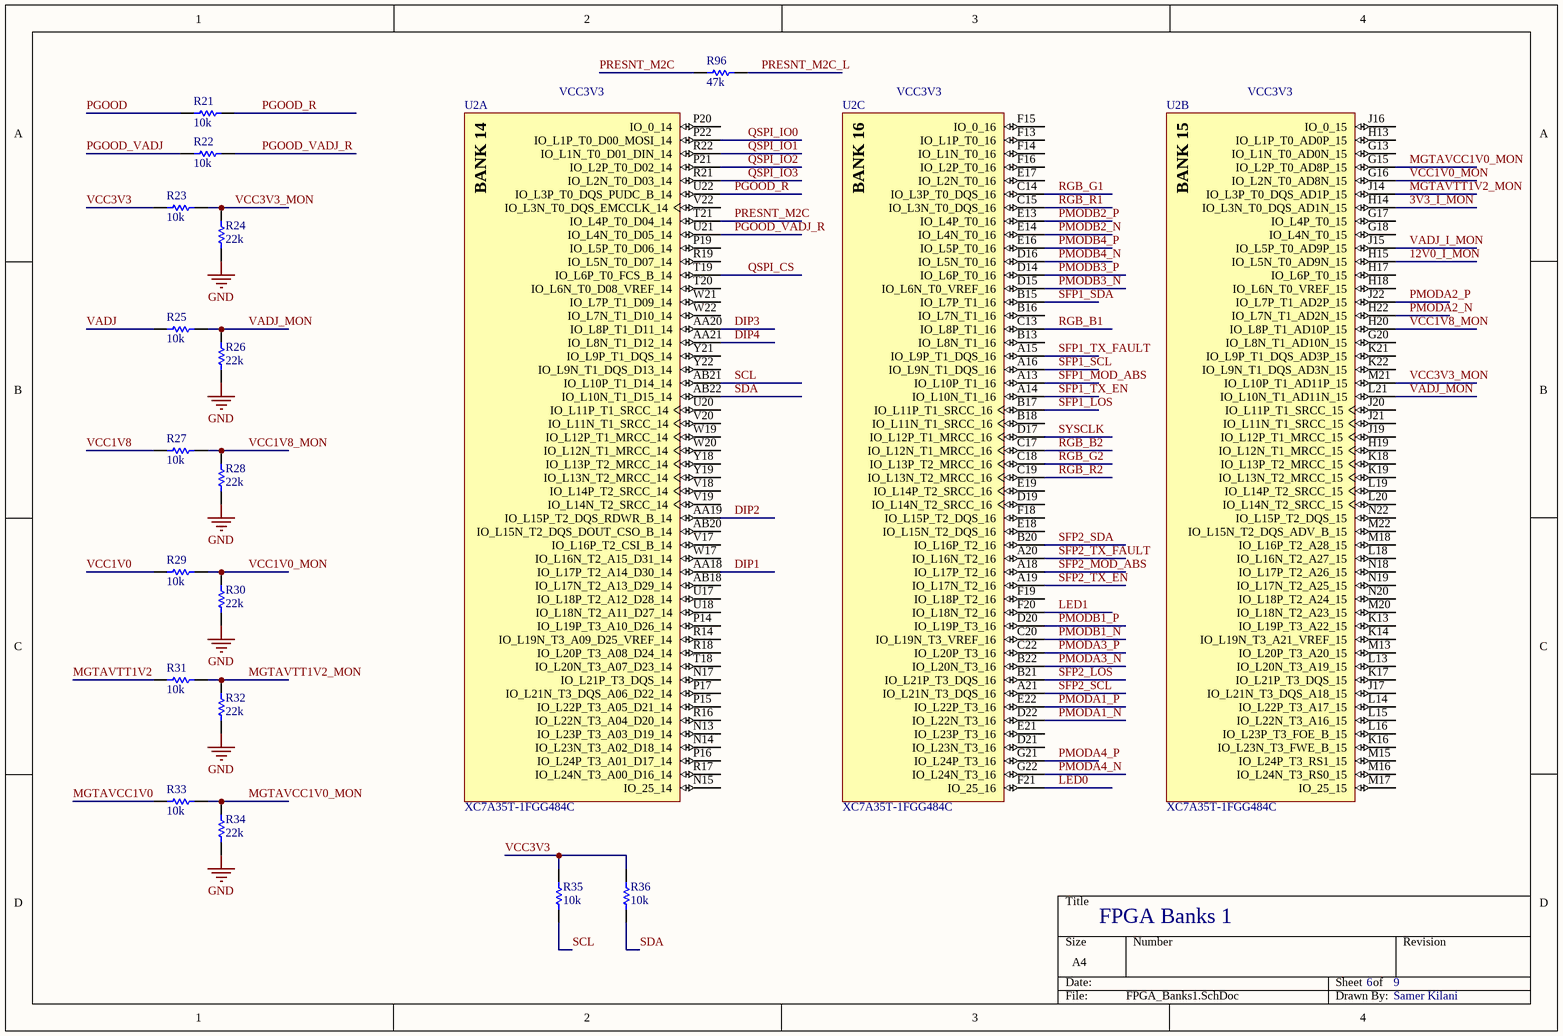
[diagram p5: FPGA_Banks1.SchDoc]

### Parts
R21  value 10k  [R0402]  (hidden comment: Res)
R22  value 10k  [R0402]  (hidden comment: Res)
R23  value 10k  [R0402]  (hidden comment: Res)
R24  value 22k  [R0402]  (hidden comment: Res)
R25  value 10k  [R0402]  (hidden comment: Res)
R26  value 22k  [R0402]  (hidden comment: Res)
R27  value 10k  [R0402]  (hidden comment: Res)
R28  value 22k  [R0402]  (hidden comment: Res)
R29  value 10k  [R0402]  (hidden comment: Res)
R30  value 22k  [R0402]  (hidden comment: Res)
R31  value 10k  [R0402]  (hidden comment: Res)
R32  value 22k  [R0402]  (hidden comment: Res)
R33  value 10k  [R0402]  (hidden comment: Res)
R34  value 22k  [R0402]  (hidden comment: Res)
R35  value 10k  [R0402]  (hidden comment: Res)
R36  value 10k  [R0402]  (hidden comment: Res)
R96  value 47k  [R0402]  (hidden comment: Res)
U2  XC7A35T-1FGG484C  [FGG484]  (parts A,B,C of 12)

### Nets
GND: R24.2 R26.2 R28.2 R30.2 R32.2 R34.2
3V3_I_MON: U2.H14(IO_L3N_T0_DQS_AD1N_15)
12V0_I_MON: U2.H15(IO_L5N_T0_AD9N_15)
DIP1: U2.AA18(IO_L17P_T2_A14_D30_14)
DIP2: U2.AA19(IO_L15P_T2_DQS_RDWR_B_14)
DIP3: U2.AA20(IO_L8P_T1_D11_14)
DIP4: U2.AA21(IO_L8N_T1_D12_14)
LED0: U2.F21(IO_25_16)
LED1: U2.F20(IO_L18N_T2_16)
MGTAVCC1V0: R33.2
MGTAVCC1V0_MON: R33.1 R34.1 U2.G15(IO_L2P_T0_AD8P_15)
MGTAVTT1V2: R31.2
MGTAVTT1V2_MON: R31.1 R32.1 U2.J14(IO_L3P_T0_DQS_AD1P_15)
PGOOD: R21.2
PGOOD_R: R21.1 U2.U22(IO_L3P_T0_DQS_PUDC_B_14)
PGOOD_VADJ: R22.2
PGOOD_VADJ_R: R22.1 U2.U21(IO_L4N_T0_D05_14)
PMODA1_N: U2.D22(IO_L22N_T3_16)
PMODA1_P: U2.E22(IO_L22P_T3_16)
PMODA2_N: U2.H22(IO_L7N_T1_AD2N_15)
PMODA2_P: U2.J22(IO_L7P_T1_AD2P_15)
PMODA3_N: U2.B22(IO_L20N_T3_16)
PMODA3_P: U2.C22(IO_L20P_T3_16)
PMODA4_N: U2.G22(IO_L24N_T3_16)
PMODA4_P: U2.G21(IO_L24P_T3_16)
PMODB1_N: U2.C20(IO_L19N_T3_VREF_16)
PMODB1_P: U2.D20(IO_L19P_T3_16)
PMODB2_N: U2.E14(IO_L4N_T0_16)
PMODB2_P: U2.E13(IO_L4P_T0_16)
PMODB3_N: U2.D15(IO_L6N_T0_VREF_16)
PMODB3_P: U2.D14(IO_L6P_T0_16)
PMODB4_N: U2.D16(IO_L5N_T0_16)
PMODB4_P: U2.E16(IO_L5P_T0_16)
PRESNT_M2C: R96.2 U2.T21(IO_L4P_T0_D04_14)
PRESNT_M2C_L: R96.1
QSPI_CS: U2.T19(IO_L6P_T0_FCS_B_14)
QSPI_IO0: U2.P22(IO_L1P_T0_D00_MOSI_14)
QSPI_IO1: U2.R22(IO_L1N_T0_D01_DIN_14)
QSPI_IO2: U2.P21(IO_L2P_T0_D02_14)
QSPI_IO3: U2.R21(IO_L2N_T0_D03_14)
RGB_B1: U2.C13(IO_L8P_T1_16)
RGB_B2: U2.C17(IO_L12N_T1_MRCC_16)
RGB_G1: U2.C14(IO_L3P_T0_DQS_16)
RGB_G2: U2.C18(IO_L13P_T2_MRCC_16)
RGB_R1: U2.C15(IO_L3N_T0_DQS_16)
RGB_R2: U2.C19(IO_L13N_T2_MRCC_16)
SCL: R35.2 U2.AB21(IO_L10P_T1_D14_14)
SDA: R36.2 U2.AB22(IO_L10N_T1_D15_14)
SFP1_LOS: U2.B17(IO_L11P_T1_SRCC_16)
SFP1_MOD_ABS: U2.A13(IO_L10P_T1_16)
SFP1_SCL: U2.A16(IO_L9N_T1_DQS_16)
SFP1_SDA: U2.B15(IO_L7P_T1_16)
SFP1_TX_EN: U2.A14(IO_L10N_T1_16)
SFP1_TX_FAULT: U2.A15(IO_L9P_T1_DQS_16)
SFP2_LOS: U2.B21(IO_L21P_T3_DQS_16)
SFP2_MOD_ABS: U2.A18(IO_L17P_T2_16)
SFP2_SCL: U2.A21(IO_L21N_T3_DQS_16)
SFP2_SDA: U2.B20(IO_L16P_T2_16)
SFP2_TX_EN: U2.A19(IO_L17N_T2_16)
SFP2_TX_FAULT: U2.A20(IO_L16N_T2_16)
SYSCLK: U2.D17(IO_L12P_T1_MRCC_16)
VADJ: R25.2
VADJ_I_MON: U2.J15(IO_L5P_T0_AD9P_15)
VADJ_MON: R25.1 R26.1 U2.L21(IO_L10N_T1_AD11N_15)
VCC1V0: R29.2
VCC1V0_MON: R29.1 R30.1 U2.G16(IO_L2N_T0_AD8N_15)
VCC1V8: R27.2
VCC1V8_MON: R27.1 R28.1 U2.H20(IO_L8P_T1_AD10P_15)
VCC3V3: R23.2 R35.1 R36.1
VCC3V3_MON: R23.1 R24.1 U2.M21(IO_L10P_T1_AD11P_15)

Not connected (* = marked no-connect by the designer): U2 AB18(IO_L17N_T2_A13_D29_14) AB20(IO_L15N_T2_DQS_DOUT_CSO_B_14) B13(IO_L8N_T1_16) B16(IO_L7N_T1_16) B18(IO_L11N_T1_SRCC_16) D19(IO_L14N_T2_SRCC_16) D21(IO_L23N_T3_16) E17(IO_L2N_T0_16) E18(IO_L15N_T2_DQS_16) E19(IO_L14P_T2_SRCC_16) E21(IO_L23P_T3_16) F13(IO_L1P_T0_16) F14(IO_L1N_T0_16) F15(IO_0_16) F16(IO_L2P_T0_16) F18(IO_L15P_T2_DQS_16) F19(IO_L18P_T2_16) G13(IO_L1N_T0_AD0N_15) G17(IO_L4P_T0_15) G18(IO_L4N_T0_15) G20(IO_L8N_T1_AD10N_15) H13(IO_L1P_T0_AD0P_15) H17(IO_L6P_T0_15) H18(IO_L6N_T0_VREF_15) H19(IO_L12N_T1_MRCC_15) J16(IO_0_15) J17(IO_L21N_T3_DQS_A18_15) J19(IO_L12P_T1_MRCC_15) J20(IO_L11P_T1_SRCC_15) J21(IO_L11N_T1_SRCC_15) K13(IO_L19P_T3_A22_15) K14(IO_L19N_T3_A21_VREF_15) K16(IO_L23N_T3_FWE_B_15) K17(IO_L21P_T3_DQS_15) K18(IO_L13P_T2_MRCC_15) K19(IO_L13N_T2_MRCC_15) K21(IO_L9P_T1_DQS_AD3P_15) K22(IO_L9N_T1_DQS_AD3N_15) L13(IO_L20N_T3_A19_15) L14(IO_L22P_T3_A17_15) L15(IO_L22N_T3_A16_15) L16(IO_L23P_T3_FOE_B_15) L18(IO_L16N_T2_A27_15) L19(IO_L14P_T2_SRCC_15) L20(IO_L14N_T2_SRCC_15) M13(IO_L20P_T3_A20_15) M15(IO_L24P_T3_RS1_15) M16(IO_L24N_T3_RS0_15) M17(IO_25_15) M18(IO_L16P_T2_A28_15) M20(IO_L18N_T2_A23_15) M22(IO_L15N_T2_DQS_ADV_B_15) N13(IO_L23P_T3_A03_D19_14) N14(IO_L23N_T3_A02_D18_14) N15(IO_25_14) N17(IO_L21P_T3_DQS_14) N18(IO_L17P_T2_A26_15) N19(IO_L17N_T2_A25_15) N20(IO_L18P_T2_A24_15) N22(IO_L15P_T2_DQS_15) P14(IO_L19P_T3_A10_D26_14) P15(IO_L22P_T3_A05_D21_14) P16(IO_L24P_T3_A01_D17_14) P17(IO_L21N_T3_DQS_A06_D22_14) P19(IO_L5P_T0_D06_14) P20(IO_0_14) R14(IO_L19N_T3_A09_D25_VREF_14) R16(IO_L22N_T3_A04_D20_14) R17(IO_L24N_T3_A00_D16_14) R18(IO_L20P_T3_A08_D24_14) R19(IO_L5N_T0_D07_14) T18(IO_L20N_T3_A07_D23_14) T20(IO_L6N_T0_D08_VREF_14) U17(IO_L18P_T2_A12_D28_14) U18(IO_L18N_T2_A11_D27_14) U20(IO_L11P_T1_SRCC_14) V17(IO_L16P_T2_CSI_B_14) V18(IO_L14P_T2_SRCC_14) V19(IO_L14N_T2_SRCC_14) V20(IO_L11N_T1_SRCC_14) V22(IO_L3N_T0_DQS_EMCCLK_14) W17(IO_L16N_T2_A15_D31_14) W19(IO_L12P_T1_MRCC_14) W20(IO_L12N_T1_MRCC_14) W21(IO_L7P_T1_D09_14) W22(IO_L7N_T1_D10_14) Y18(IO_L13P_T2_MRCC_14) Y19(IO_L13N_T2_MRCC_14) Y21(IO_L9P_T1_DQS_14) Y22(IO_L9N_T1_DQS_D13_14)

### Notes on the sheet
- VCC3V3
- (in symbol XC7A35T-1FGG484C, part A) BANK 14
- (in symbol XC7A35T-1FGG484C, part B) BANK 15
- (in symbol XC7A35T-1FGG484C, part C) BANK 16

### Library data of the parts
R21-R36 R96 = Res: Resistor
U2 = XC7A35T-1FGG484C: as U2 on sheet FPGA_PWR; DatasheetVersion: v1.15; PackageVersion: Rev. 1.11; PackageReference: FGG484; PackageDescription: 484-Ball Wire-Bond Fine-Pitch BGA, Body 23 x 23 mm, Pitch 1 mm; Maximum Distributed RAM: 400 Kb; Operating Temperature Range: Commercial; NexusDeviceID: XC7A35T-1FGG484C; Mounting Technology: Surface Mount; PartNumber: XC7A35T-1FGG484C; ComponentLink1Description: Manufacturer URL; ComponentLink1URL: http://www.xilinx.com/; ComponentLink2Description: Datasheet; ComponentLink2URL: http://www.xilinx.com/support/documentation/data_sheets/ds180_7Series_Overview.pdf; ComponentLink3Description: Package Specification; ComponentLink3URL: http://www.xilinx.com/support/documentation/user_guides/ug475_7Series_Pkg_Pinout.pdf; ComponentLink4Description: DC and Switching Characteristics; ComponentLink4URL: http://www.xilinx.com/support/documentation/data_sheets/ds181_Artix_7_Data_Sheet.pdf; ComponentLink5Description: Package File; ComponentLink5URL: http://www.xilinx.com/support/packagefiles/a7packages/xc7a200tsbg484pkg.txt; ComponentLink6Description: Packaging and Pinout; ComponentLink6URL: http://www.xilinx.com/support/documentation/user_guides/ug475_7Series_Pkg_Pinout.pdf

## Sheet FPGA_Banks2.SchDoc: FPGA Banks 2
size A4; Engineer: Samer Kilani; DocumentNumber: 7; SheetNumber: 7; SheetTotal: 9
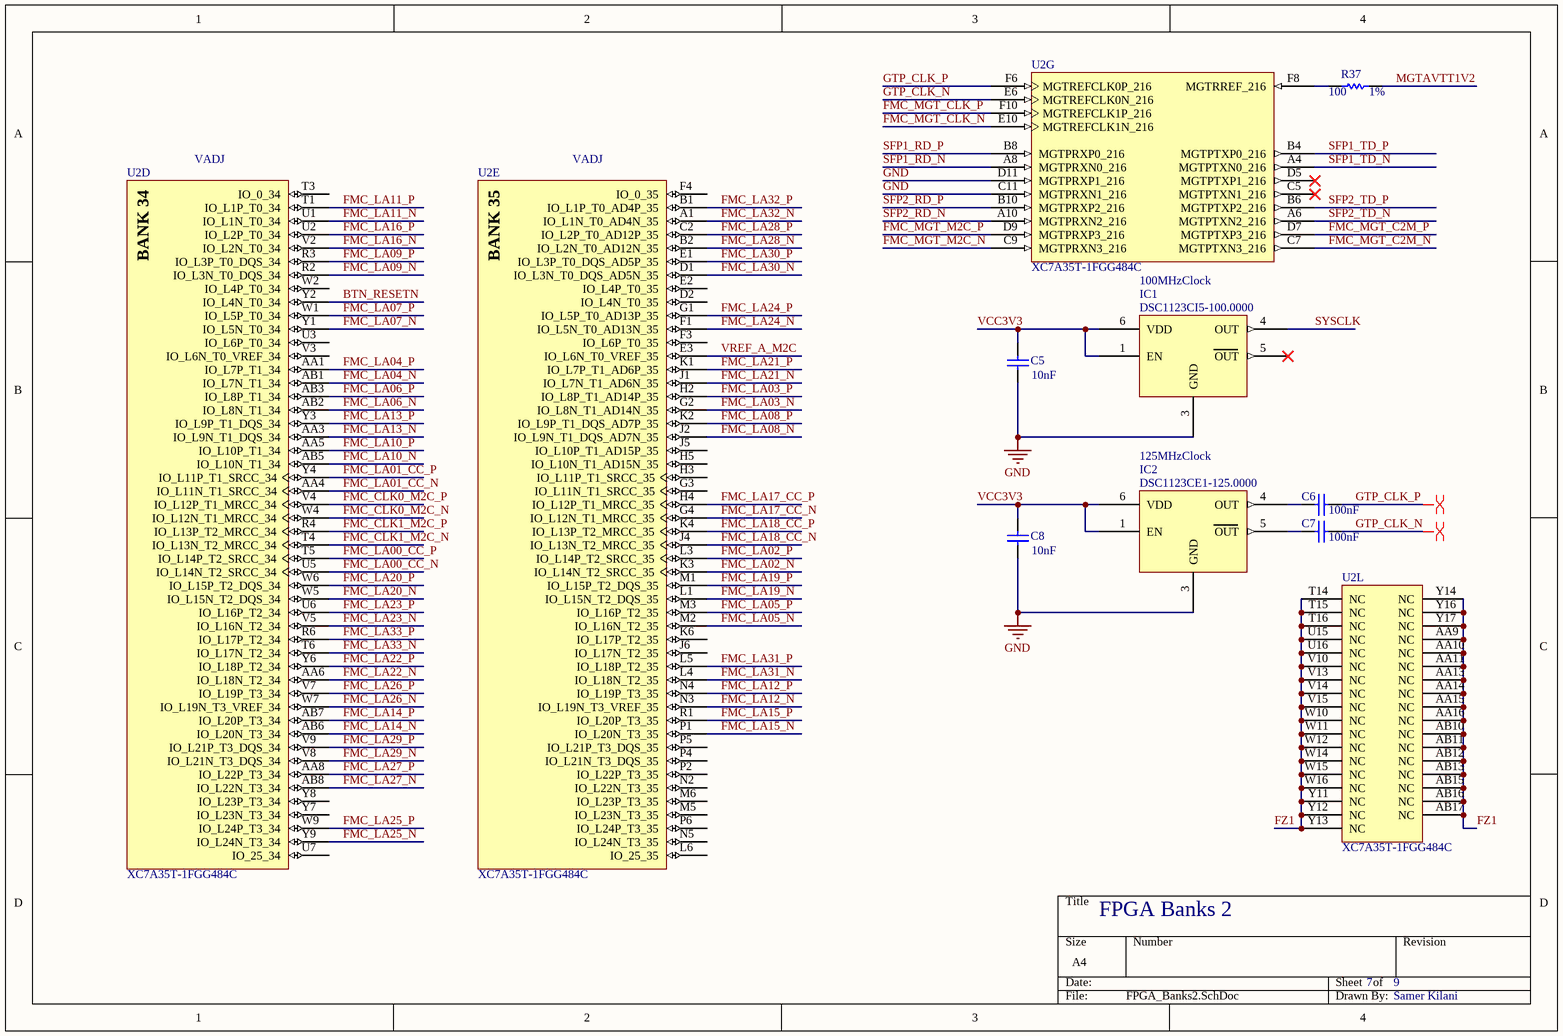
[diagram p6: FPGA_Banks2.SchDoc]

### Parts
C5  value 10nF  [C0402]  (hidden comment: Cap)
C6  value 100nF  [C0402]  (hidden comment: Cap)
C7  value 100nF  [C0402]  (hidden comment: Cap)
C8  value 10nF  [C0402]  (hidden comment: Cap)
IC1  DSC1123CI5-100.0000  [DSC1123_32_25]
IC2  DSC1123CE1-125.0000  [DSC1123_32_25]
R37  value 100  Tolerance: 1%  [R0402]  (hidden comment: Res)
U2  XC7A35T-1FGG484C  [FGG484]  (parts D,E,G,L of 12)

### Nets
GND: C5.1 C8.1 IC1.3(GND) IC2.3(GND) U2.C11(MGTPRXN1_216) U2.D11(MGTPRXP1_216)
BTN_RESETN: U2.Y2(IO_L4N_T0_34)
FMC_CLK0_M2C_N: U2.W4(IO_L12N_T1_MRCC_34)
FMC_CLK0_M2C_P: U2.V4(IO_L12P_T1_MRCC_34)
FMC_CLK1_M2C_N: U2.T4(IO_L13N_T2_MRCC_34)
FMC_CLK1_M2C_P: U2.R4(IO_L13P_T2_MRCC_34)
FMC_LA00_CC_N: U2.U5(IO_L14N_T2_SRCC_34)
FMC_LA00_CC_P: U2.T5(IO_L14P_T2_SRCC_34)
FMC_LA01_CC_N: U2.AA4(IO_L11N_T1_SRCC_34)
FMC_LA01_CC_P: U2.Y4(IO_L11P_T1_SRCC_34)
FMC_LA02_N: U2.K3(IO_L14N_T2_SRCC_35)
FMC_LA02_P: U2.L3(IO_L14P_T2_SRCC_35)
FMC_LA03_N: U2.G2(IO_L8N_T1_AD14N_35)
FMC_LA03_P: U2.H2(IO_L8P_T1_AD14P_35)
FMC_LA04_N: U2.AB1(IO_L7N_T1_34)
FMC_LA04_P: U2.AA1(IO_L7P_T1_34)
FMC_LA05_N: U2.M2(IO_L16N_T2_35)
FMC_LA05_P: U2.M3(IO_L16P_T2_35)
FMC_LA06_N: U2.AB2(IO_L8N_T1_34)
FMC_LA06_P: U2.AB3(IO_L8P_T1_34)
FMC_LA07_N: U2.Y1(IO_L5N_T0_34)
FMC_LA07_P: U2.W1(IO_L5P_T0_34)
FMC_LA08_N: U2.J2(IO_L9N_T1_DQS_AD7N_35)
FMC_LA08_P: U2.K2(IO_L9P_T1_DQS_AD7P_35)
FMC_LA09_N: U2.R2(IO_L3N_T0_DQS_34)
FMC_LA09_P: U2.R3(IO_L3P_T0_DQS_34)
FMC_LA10_N: U2.AB5(IO_L10N_T1_34)
FMC_LA10_P: U2.AA5(IO_L10P_T1_34)
FMC_LA11_N: U2.U1(IO_L1N_T0_34)
FMC_LA11_P: U2.T1(IO_L1P_T0_34)
FMC_LA12_N: U2.N3(IO_L19N_T3_VREF_35)
FMC_LA12_P: U2.N4(IO_L19P_T3_35)
FMC_LA13_N: U2.AA3(IO_L9N_T1_DQS_34)
FMC_LA13_P: U2.Y3(IO_L9P_T1_DQS_34)
FMC_LA14_N: U2.AB6(IO_L20N_T3_34)
FMC_LA14_P: U2.AB7(IO_L20P_T3_34)
FMC_LA15_N: U2.P1(IO_L20N_T3_35)
FMC_LA15_P: U2.R1(IO_L20P_T3_35)
FMC_LA16_N: U2.V2(IO_L2N_T0_34)
FMC_LA16_P: U2.U2(IO_L2P_T0_34)
FMC_LA17_CC_N: U2.G4(IO_L12N_T1_MRCC_35)
FMC_LA17_CC_P: U2.H4(IO_L12P_T1_MRCC_35)
FMC_LA18_CC_N: U2.J4(IO_L13N_T2_MRCC_35)
FMC_LA18_CC_P: U2.K4(IO_L13P_T2_MRCC_35)
FMC_LA19_N: U2.L1(IO_L15N_T2_DQS_35)
FMC_LA19_P: U2.M1(IO_L15P_T2_DQS_35)
FMC_LA20_N: U2.W5(IO_L15N_T2_DQS_34)
FMC_LA20_P: U2.W6(IO_L15P_T2_DQS_34)
FMC_LA21_N: U2.J1(IO_L7N_T1_AD6N_35)
FMC_LA21_P: U2.K1(IO_L7P_T1_AD6P_35)
FMC_LA22_N: U2.AA6(IO_L18N_T2_34)
FMC_LA22_P: U2.Y6(IO_L18P_T2_34)
FMC_LA23_N: U2.V5(IO_L16N_T2_34)
FMC_LA23_P: U2.U6(IO_L16P_T2_34)
FMC_LA24_N: U2.F1(IO_L5N_T0_AD13N_35)
FMC_LA24_P: U2.G1(IO_L5P_T0_AD13P_35)
FMC_LA25_N: U2.Y9(IO_L24N_T3_34)
FMC_LA25_P: U2.W9(IO_L24P_T3_34)
FMC_LA26_N: U2.W7(IO_L19N_T3_VREF_34)
FMC_LA26_P: U2.V7(IO_L19P_T3_34)
FMC_LA27_N: U2.AB8(IO_L22N_T3_34)
FMC_LA27_P: U2.AA8(IO_L22P_T3_34)
FMC_LA28_N: U2.B2(IO_L2N_T0_AD12N_35)
FMC_LA28_P: U2.C2(IO_L2P_T0_AD12P_35)
FMC_LA29_N: U2.V8(IO_L21N_T3_DQS_34)
FMC_LA29_P: U2.V9(IO_L21P_T3_DQS_34)
FMC_LA30_N: U2.D1(IO_L3N_T0_DQS_AD5N_35)
FMC_LA30_P: U2.E1(IO_L3P_T0_DQS_AD5P_35)
FMC_LA31_N: U2.L4(IO_L18N_T2_35)
FMC_LA31_P: U2.L5(IO_L18P_T2_35)
FMC_LA32_N: U2.A1(IO_L1N_T0_AD4N_35)
FMC_LA32_P: U2.B1(IO_L1P_T0_AD4P_35)
FMC_LA33_N: U2.T6(IO_L17N_T2_34)
FMC_LA33_P: U2.R6(IO_L17P_T2_34)
FMC_MGT_C2M_N: U2.C7(MGTPTXN3_216)
FMC_MGT_C2M_P: U2.D7(MGTPTXP3_216)
FMC_MGT_CLK_N: U2.E10(MGTREFCLK1N_216)
FMC_MGT_CLK_P: U2.F10(MGTREFCLK1P_216)
FMC_MGT_M2C_N: U2.C9(MGTPRXN3_216)
FMC_MGT_M2C_P: U2.D9(MGTPRXP3_216)
FZ1: U2.AA9(NC) U2.AA10(NC) U2.AA11(NC) U2.AA13(NC) U2.AA14(NC) U2.AA15(NC) U2.AA16(NC) U2.AB10(NC) U2.AB11(NC) U2.AB12(NC) U2.AB13(NC) U2.AB15(NC) U2.AB16(NC) U2.AB17(NC) U2.T14(NC) U2.T15(NC) U2.T16(NC) U2.U15(NC) U2.U16(NC) U2.V10(NC) U2.V13(NC) U2.V14(NC) U2.V15(NC) U2.W10(NC) U2.W11(NC) U2.W12(NC) U2.W14(NC) U2.W15(NC) U2.W16(NC) U2.Y11(NC) U2.Y12(NC) U2.Y13(NC) U2.Y14(NC) U2.Y16(NC) U2.Y17(NC)
GTP_CLK_N: C7.2 U2.E6(MGTREFCLK0N_216)
GTP_CLK_P: C6.2 U2.F6(MGTREFCLK0P_216)
MGTAVTT1V2: R37.1
SFP1_RD_N: U2.A8(MGTPRXN0_216)
SFP1_RD_P: U2.B8(MGTPRXP0_216)
SFP1_TD_N: U2.A4(MGTPTXN0_216)
SFP1_TD_P: U2.B4(MGTPTXP0_216)
SFP2_RD_N: U2.A10(MGTPRXN2_216)
SFP2_RD_P: U2.B10(MGTPRXP2_216)
SFP2_TD_N: U2.A6(MGTPTXN2_216)
SFP2_TD_P: U2.B6(MGTPTXP2_216)
SYSCLK: IC1.4(OUT)
VCC3V3: C5.2 C8.2 IC1.1(EN) IC1.6(VDD) IC2.1(EN) IC2.6(VDD)
VREF_A_M2C: U2.E3(IO_L6N_T0_VREF_35)
NetC6_1: C6.1 IC2.4(OUT)
NetC7_1: C7.1 IC2.5(OUT)
NetR37_2: R37.2 U2.F8(MGTRREF_216)

Not connected (* = marked no-connect by the designer): IC1 5(OUT)*; U2 C5(MGTPTXN1_216)* D2(IO_L4N_T0_35) D5(MGTPTXP1_216)* E2(IO_L4P_T0_35) F3(IO_L6P_T0_35) F4(IO_0_35) G3(IO_L11N_T1_SRCC_35) H3(IO_L11P_T1_SRCC_35) H5(IO_L10N_T1_AD15N_35) J5(IO_L10P_T1_AD15P_35) J6(IO_L17N_T2_35) K6(IO_L17P_T2_35) L6(IO_25_35) M5(IO_L23N_T3_35) M6(IO_L23P_T3_35) N2(IO_L22N_T3_35) N5(IO_L24N_T3_35) P2(IO_L22P_T3_35) P4(IO_L21N_T3_DQS_35) P5(IO_L21P_T3_DQS_35) P6(IO_L24P_T3_35) T3(IO_0_34) U3(IO_L6P_T0_34) U7(IO_25_34) V3(IO_L6N_T0_VREF_34) W2(IO_L4P_T0_34) Y7(IO_L23N_T3_34) Y8(IO_L23P_T3_34)

### Layout directives
differential pair: GTP_CLK_N, GTP_CLK_P

### Notes on the sheet
- VADJ
- 100MHzClock
- 125MHzClock
- (in symbol XC7A35T-1FGG484C, part D) BANK 34
- (in symbol XC7A35T-1FGG484C, part E) BANK 35

### Library data of the parts
C5-C8 = Cap: Capacitor; Published: 8-Jun-2000; LatestRevisionDate: 17-Jul-2002; LatestRevisionNote: Re-released for DXP Platform.; PackageReference: RAD-0.3; Publisher: Altium Limited; PackageDescription: Radial Cap, Thru-Hole; 2 Leads; 0.3 in Pin Spacing
IC1 IC2 = DSC1123: Standard Clock Oscillators Oscillator Hi Perf -20C-70C 50ppm
  IC1: PartNo: DSC1123CI5-100.0000
  IC2: PartNo: DSC1123CE1-125.0000
R37 = Res: Resistor
U2 = XC7A35T-1FGG484C: as U2 on sheet FPGA_PWR; DatasheetVersion: v1.15; PackageVersion: Rev. 1.11; PackageReference: FGG484; PackageDescription: 484-Ball Wire-Bond Fine-Pitch BGA, Body 23 x 23 mm, Pitch 1 mm; Maximum Distributed RAM: 400 Kb; Operating Temperature Range: Commercial; NexusDeviceID: XC7A35T-1FGG484C; Mounting Technology: Surface Mount; PartNumber: XC7A35T-1FGG484C; ComponentLink1Description: Manufacturer URL; ComponentLink1URL: http://www.xilinx.com/; ComponentLink2Description: Datasheet; ComponentLink2URL: http://www.xilinx.com/support/documentation/data_sheets/ds180_7Series_Overview.pdf; ComponentLink3Description: Package Specification; ComponentLink3URL: http://www.xilinx.com/support/documentation/user_guides/ug475_7Series_Pkg_Pinout.pdf; ComponentLink4Description: DC and Switching Characteristics; ComponentLink4URL: http://www.xilinx.com/support/documentation/data_sheets/ds181_Artix_7_Data_Sheet.pdf; ComponentLink5Description: Package File; ComponentLink5URL: http://www.xilinx.com/support/packagefiles/a7packages/xc7a200tsbg484pkg.txt; ComponentLink6Description: Packaging and Pinout; ComponentLink6URL: http://www.xilinx.com/support/documentation/user_guides/ug475_7Series_Pkg_Pinout.pdf